# Altium project 一体机V1 修订2.PrjPcb (part 1 of 2)
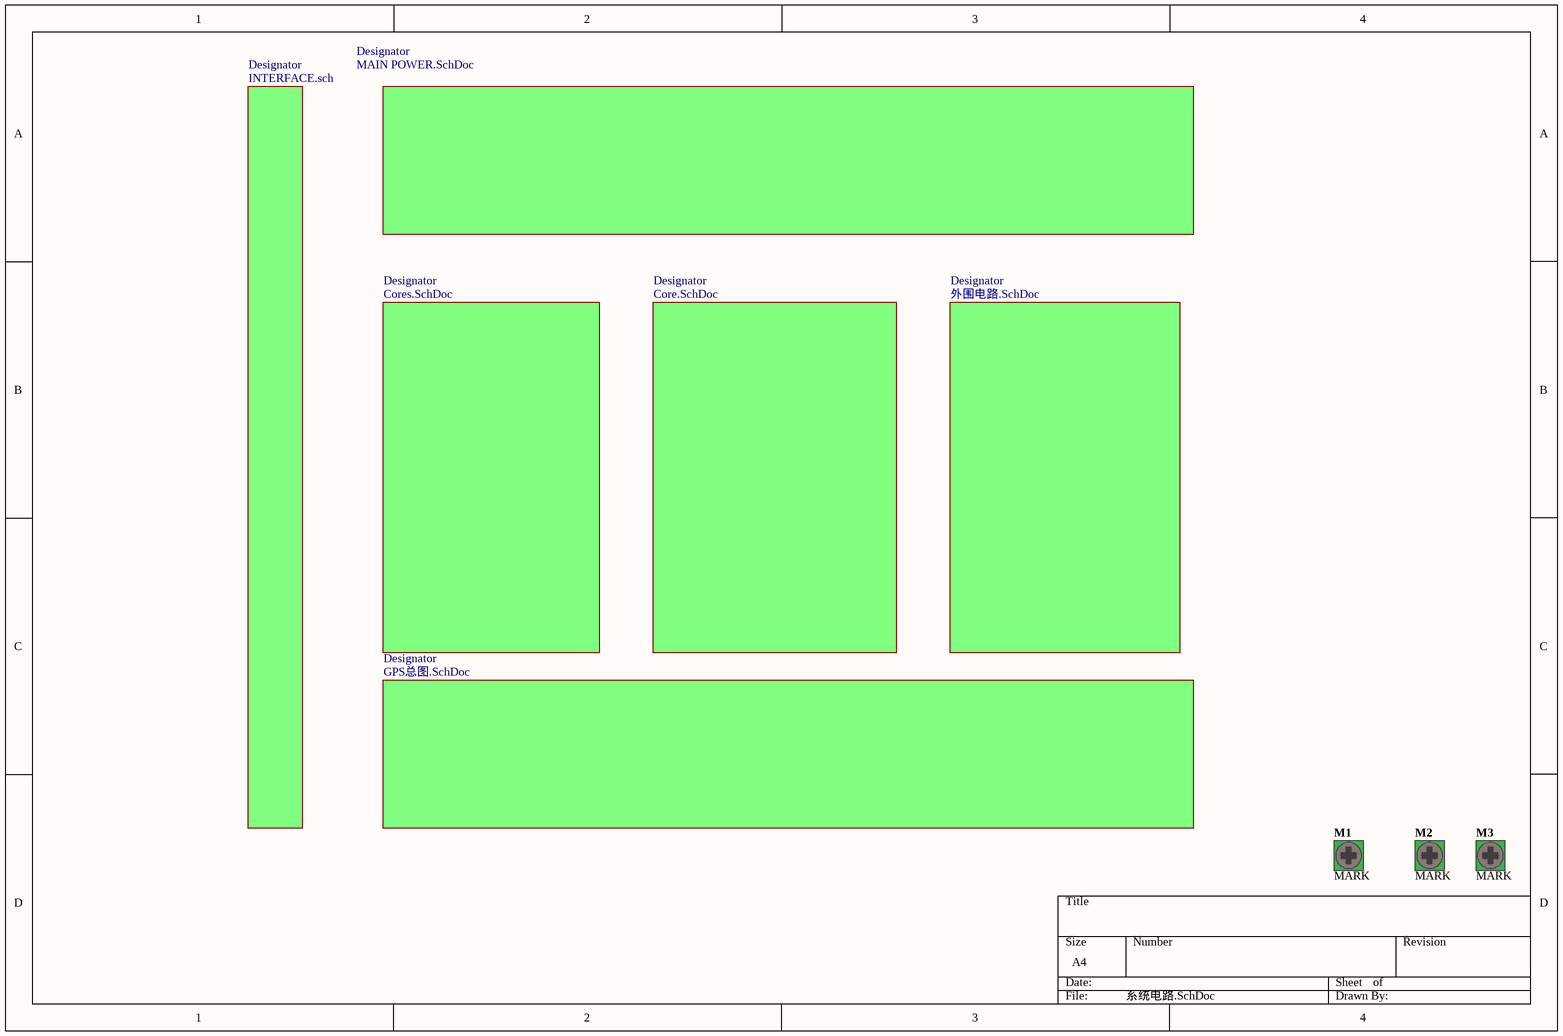
[diagram p0: 系统电路.SchDoc]
24 sheets, 224 parts. Net scope: global (net labels, ports and power ports of the same name join across sheets).
Board file: 一体机V1.PcbDoc
Sheets:
  系统电路.SchDoc
    Designator = Core.SchDoc
      Designator = ARM POWER.SchDoc
    Designator = MAIN POWER.SchDoc
    Designator = Cores.SchDoc
      Designator = JTAG.SchDoc
      Designator = RTC.SchDoc
      Designator = 按键接口.SchDoc
      Designator = 指示灯.SchDoc
      Designator = IIC.SchDoc
      Designator = RESET.SchDoc
      Designator = USB Device.SchDoc
      Designator = USB Host.SchDoc
      Designator = 蜂鸣器.SchDoc
      Designator = Cores POWER.SchDoc
      Designator = LVDS.SchDoc
    Designator = 外围电路.SchDoc
    Designator = GPS总图.SchDoc
      Designator = 12-MSP430.SchDoc
      Designator = 13-GPRS.SchDoc
      Designator = 14-GPS.SchDoc
      Designator = GPS POWER.SchDoc
      Designator = BAT POWER.SchDoc
      Designator = CD4060BM_硬件定时器.SchDoc

## Sheet 系统电路.SchDoc
size A4

### Parts
M1  MARK  [Mark]  (no BOM)
M2  MARK  [Mark]  (no BOM)
M3  MARK  [Mark]  (no BOM)

### Sub-sheets
Designator = Core.SchDoc: no entries
Designator = MAIN POWER.SchDoc: no entries
Designator = Cores.SchDoc: no entries
Designator = 外围电路.SchDoc: no entries
Designator = GPS总图.SchDoc: no entries
Designator = INTERFACE.sch (file not in this document): no entries

### Nets

Not connected (* = marked no-connect by the designer): M1 1; M2 1; M3 1

### Library data of the parts
M1-M3 = D-001-0001: Mounting Hole, M3 Screw, Plated, Square Pad; Status: Production; Category: Mounting-Hole

## Sheet Core.SchDoc
size A4
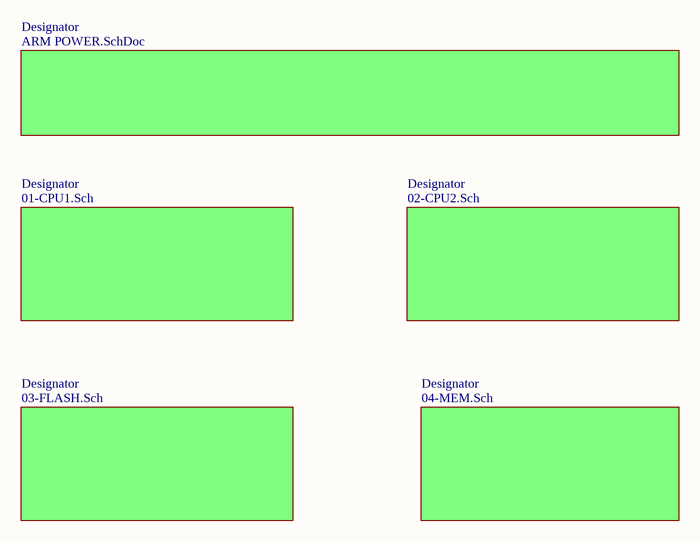
[diagram p1: Core.SchDoc]

### Sub-sheets
Designator = 01-CPU1.Sch (file not in this document): no entries
Designator = 02-CPU2.Sch (file not in this document): no entries
Designator = 04-MEM.Sch (file not in this document): no entries
Designator = ARM POWER.SchDoc: no entries
Designator = 03-FLASH.Sch (file not in this document): no entries

## Sheet ARM POWER.SchDoc
size A4
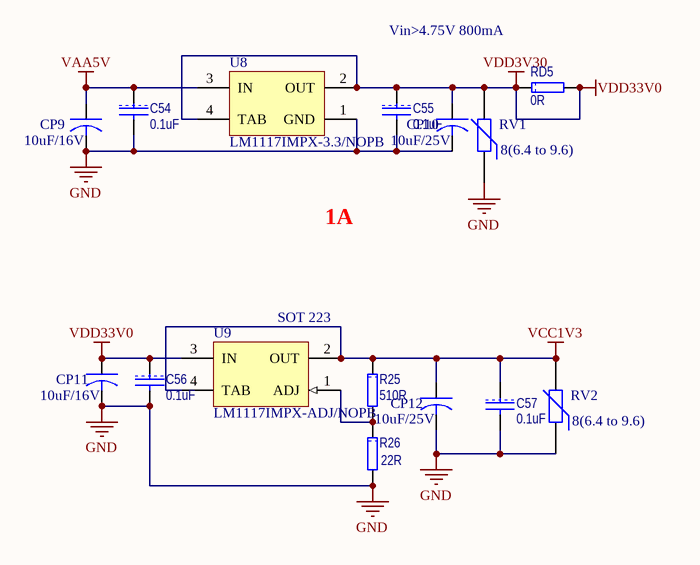
[diagram p2: ARM POWER.SchDoc]

### Parts
C54  0.1uF  [1608[0603]]
C55  0.1uF  [1608[0603]]
C56  0.1uF  [1608[0603]]
C57  0.1uF  [1608[0603]]
CP9  10uF/16V  [3216[1206]]
CP10  10uF/25V  [6032[2312]CC]
CP11  10uF/16V  [3216[1206]]
CP12  10uF/25V  [6032[2312]CC]
R25  510R  [1608[0603]R]
R26  22R  [1608[0603]R]
RD5  0R
RV1  8(6.4 to 9.6)  [1608[0603]RV]
RV2  8(6.4 to 9.6)  [1608[0603]RV]
U8  LM1117IMPX-3.3/NOPB  [MP04A_N]
U9  LM1117IMPX-ADJ/NOPB  [MP04A_N]

### Nets
GND: C54.2 C55.2 C56.2 C57.2 CP9.2 CP10.2 CP11.2 CP12.2 R26.2 RV1.1 RV2.1 U8.1(GND)
VAA5V: C54.1 CP9.1 U8.3(IN)
VCC1V3: C57.1 CP12.1 R25.1 RV2.2 U9.2(OUT) U9.4(TAB)
VDD33V0: C55.1 C56.1 CP10.1 CP11.1 RD5.1 RD5.2 RV1.2 U8.2(OUT) U8.4(TAB) U9.3(IN)  [also labelled VDD3V30]
NetR25_2: R25.2 R26.1 U9.1(ADJ)

### Notes on the sheet
- Vin>4.75V 800mA
- 1A
- (near U9) SOT 223

### Library data of the parts
C54-C57 = CAP: Capacitor; Manufacturer: TDK; Type: 无铅电容; Model: C0603X7R1H104K; Value: 0.1uF
CP9-CP12 = CAPACITOR: Tantalum Capacitor; Compy: TAJ; name: TAJ-A-106-M-010-R
R25 = RES: Manufacturer: vishay; Model: RT0603DRD7D510RL; Value: 510R; Type: 无铅电阻
R26 = RES: Manufacturer: vishay; Model: CRCW060322R0KKEDTR; Value: 22R; Type: 无铅电阻
RD5 = RES: Manufacturer: vishay; Model: RT0603DRD7D0RL; Value: 0R; Type: 无铅电阻
RV1 RV2 = Res Varistor: 压敏电阻; Manufacture: TDK; Value: AVR-M1608C080MAAB; Published: 24-Mar-1999; LatestRevisionDate: 29-May-2009; LatestRevisionNote: IPC-7351 Footprint Added.; PackageVersion: Mar-2003; PackageReference: 6-0805; Publisher: Altium Limited; PackageDescription: Chip Resistor 0805 Case Size; Code_IPC: RESC2012
U8 = LM1117MPX-3.3/NOPB: 800mA Low-Dropout Linear Regulator, 4-pin SOT-223, Pb-Free; Manufacturer: National Semiconductor; PackageTopMarking: XYTT*N05A; PowerWise: N; CompType: LDO IC; Published: 1-Mar-2010; DatasheetVersion: Apr-2006; PackageVersion: revB, Apr-2003; PackageReference: MP04A; Publisher: Altium Limited; PackageDescription: Molded SOT-223, 6.50 x 3.56 x 1.6mm Body, 4 Lead, 2.3mm Pitch; Supplier 1: Digi-Key; Supplier Part Number 1: LM1117MPX-3.3TR-ND; Supplier 2: Digi-Key; Supplier Part Number 2: LM1117MPX-3.3CT-ND; Supplier 3: Digi-Key; Supplier Part Number 3: LM1117MPX-3.3DKR-ND; PartNumber: LM1117MPX-3.3/NOPB; RoHS: Y; PinCount: 4; Code_JEDEC: TO-261-AA; Code_IPC: SOT223-4; ComponentLink1Description: LM1117 Datasheet; ComponentLink1URL: http://www.national.com/ds/LM/LM1117.pdf; ComponentLink2Description: LM1117 Web Page; ComponentLink2URL: http://www.national.com/pf/LM/LM1117.html; ComponentLink3Description: MP04A Package Page; ComponentLink3URL: http://www.national.com/packaging/folders/mp04a.html
U9 = LM1117MPX-ADJ/NOPB: 800mA Low-Dropout Linear Regulator, 4-pin SOT-223, Pb-Free; Manufacturer: National Semiconductor; PackageTopMarking: XYTT*N03A; PowerWise: N; CompType: LDO IC; Published: 1-Mar-2010; DatasheetVersion: Apr-2006; PackageVersion: revB, Apr-2003; PackageReference: MP04A; Publisher: Altium Limited; PackageDescription: Molded SOT-223, 6.50 x 3.56 x 1.6mm Body, 4 Lead, 2.3mm Pitch; Supplier 1: Digi-Key; Supplier Part Number 1: LM1117MPX-ADJ-ND; PartNumber: LM1117MPX-ADJ/NOPB; RoHS: Y; PinCount: 4; Code_JEDEC: TO-261-AA; Code_IPC: SOT223-4; ComponentLink1Description: LM1117 Datasheet; ComponentLink1URL: http://www.national.com/ds/LM/LM1117.pdf; ComponentLink2Description: LM1117 Web Page; ComponentLink2URL: http://www.national.com/pf/LM/LM1117.html; ComponentLink3Description: MP04A Package Page; ComponentLink3URL: http://www.national.com/packaging/folders/mp04a.html

## Sheet MAIN POWER.SchDoc
size A4
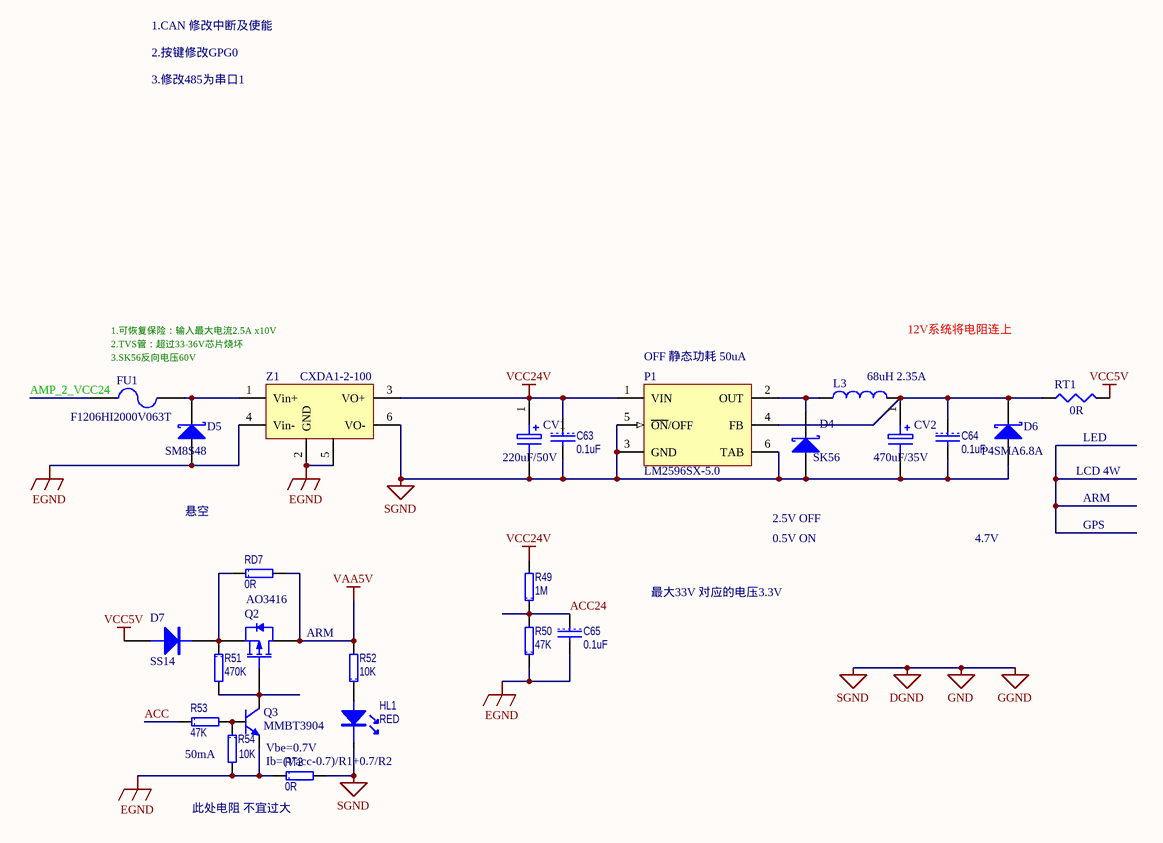
[diagram p3: MAIN POWER.SchDoc]

### Parts
C63  0.1uF  [1608[0603]]
C64  0.1uF  [1608[0603]]
C65  0.1uF  [1608[0603]]
CV1  220uF/50V  [CAPPR5-10x20/H1.1]
CV2  470uF/35V  [CAPPR5-10x20/H1.1]
D4  SK56  [DIODE_SMC]
D5  SM8S48  [DIODE_SMC]
D6  P4SMA6.8A  [SMA]
D7  SS14  [SMA]
FU1  F1206HI2000V063T  [RAD-0.3]
HL1  RED  [0805LED]
L3  value 68uH 2.35A  [INDP125125X85N]  (hidden comment: B82477P4683M000)
P1  LM2596SX-5.0  [TS5B_N]
Q2  AO3416  [SOT23_N]
Q3  MMBT3904  [SOT23-NPN]
R49  1M  [1608[0603]R]
R50  47K  [1608[0603]R]
R51  470K  [1608[0603]R]
R52  10K  [1608[0603]R]
R53  47K  [1608[0603]R]
R54  10K  [1608[0603]R]
RD7  0R  [1608[0603]RD]
RT1  0R  [2012[0805]]
RT2  0R  [1608[0603]RD]
Z1  CXDA1-2-100  [CXDA1-2-100]

### Nets
EGND: C65.2 D5.1(A) Q3.1 R50.1 R54.2 RT2.1 Z1.2(GND) Z1.4(Vin-) Z1.5(GND)
GND: C63.2 C64.2 CV1.2 CV2.2 D4.1(A) D6.1(A) HL1.2 P1.3(GND) P1.5(~{ON}/OFF) P1.6(TAB) RT2.2 Z1.6(VO-)  [also labelled DGND, GGND, SGND]
VAA5V: Q2.3(D) R52.2 RD7.2
VCC5V: D7.1(A) RT1.2
VCC24V: C63.1 CV1.1 P1.1(VIN) R49.2 Z1.3(VO+)
ACC: R53.1
ACC24: C65.1 R49.1 R50.2
AMP_2_VCC24: FU1.1
NetC64_1: C64.1 CV2.1 D6.2(K) L3.2 P1.4(FB) RT1.1
NetD4_2: D4.2(K) L3.1 P1.2(OUT)
NetD5_2: D5.2(K) FU1.2 Z1.1(Vin+)
NetD7_2: D7.2(K) Q2.2(S) R51.1 RD7.1
NetHL1_1: HL1.1 R52.1
NetQ2_1: Q2.1(G) Q3.3 R51.2
NetQ3_2: Q3.2 R53.2 R54.1

### Notes on the sheet
- 1.CAN 修改中断及使能
- 2.按键修改GPG0
- 3.修改485为串口1
- 1.可恢复保险：输入最大电流2.5A x10V
- 2.TVS管：超过33-36V芯片烧坏
- (near FU1) 3.SK56反向电压60V
- (near P1) OFF 静态功耗 50uA
- 12V系统将电阻连上
- (near RT1) LED
- LCD 4W
- ARM
- 悬空
- 2.5V OFF
- 0.5V ON
- 4.7V
- GPS
- 最大33V 对应的电压3.3V
- 50mA
- (near Q3) Vbe=0.7V
- Ib=(Vacc-0.7)/R1+0.7/R2
- 此处电阻 不宜过大

### Library data of the parts
C63-C65 = CAP: as C54 on sheet ARM POWER; Value: 0.1uF
CV1 = ELECTRO1: aluminum electrolytic capacitor; Manufacturer: Yageo; Value: 220uF; Model: SL050K0220A5S-1019; Parameter: 220uF/50V
CV2 = ELECTRO1: aluminum electrolytic capacitor; Manufacturer: Yageo; Value: 470uF; Model: SL050K0220A5S-1019; Parameter: 470uF/35V
D4 = D Schottky: 肖特基二极管; Published: 8-Jun-2000; LatestRevisionDate: 17-Jul-2002; LatestRevisionNote: Re-released for DXP Platform.; PackageReference: SMB; Publisher: Altium Limited; PackageDescription: DO-214-AA/SMB; 2 C-Bend Leads; Body 5.3 x 3.6 mm, inc. leads (LxW); Code_JEDEC: DO-214-AA
D5 D6 = 30BQ040: TVS; 公司: Vishay; Published: 8-Jun-2000; LatestRevisionDate: 17-Jul-2002; LatestRevisionNote: Re-released for DXP Platform.; DatasheetVersion: PD-2.439; PackageReference: SMC; Publisher: Altium Limited; PackageDescription: DO-214-AB/SMC; 2 C-Bend Leads; Body 7.9 x 5.9 mm, inc. leads (LxW); Code_JEDEC: DO-214-AB; ComponentLink1Description: Manufacturer Link; ComponentLink1URL: http://www.irf.com/; ComponentLink2Description: Datasheet; ComponentLink2URL: http://www.irf.com/product-info/datasheets/data/30bq040.pdf; 参数: *
D7 = DIODE
FU1 = Fuse 2: FUSE; 公司: 美国泰科; 参数: 63V 2A; Published: 8-Jun-2000; LatestRevisionDate: 17-Jul-2002; LatestRevisionNote: Re-released for DXP Platform.; PackageReference: PIN-W2/E2.8; Publisher: Altium Limited; PackageDescription: Thru-Hole; 2 Leads
HL1 = LED: 发光管; Votage: 1.82-1.88V; I: 5-8mA
L3 = Inductor: Code_IEC: 1005; parameters: 3.5A; 公司: epcos; Published: 8-Jun-2000; LatestRevisionDate: 29-May-2009; LatestRevisionNote: IPC-7351 Footprint Added.; PackageReference: 0402-A; Publisher: Altium Limited; PackageDescription: Chip Inductor; Code_JEITA: 0402; Manufacturer: *
P1 = LM2596SX-12: POWER; Manufacturer: National Semiconductor; PackageTopMarking: NSUZXYTTE#*LM2596S*-12 P+; PowerWise: N; CompType: Switcher; Published: 1-Mar-2010; DatasheetVersion: May-2002; PackageVersion: revD, Apr-2005; PackageReference: TS5B; Publisher: Altium Limited; PackageDescription: TO-263, Molded, .400 x .390 x .180in, 5 Lead, .067in Pitch, Surface Mount; PartNumber: LM2596SX-12; RoHS: N; PinCount: 5; Code_JEDEC: MO-169-AB; ComponentLink1Description: LM2596 Datasheet; ComponentLink1URL: http://www.national.com/ds/LM/LM2596.pdf; ComponentLink2Description: LM2596 Web Page; ComponentLink2URL: http://www.national.com/pf/LM/LM2596.html; ComponentLink3Description: TS5B Package Page; ComponentLink3URL: http://www.national.com/packaging/folders/ts5b.html; Supplier 1: Digi-Key; Supplier Part Number 1: LM2596SX-12-ND
Q2 = BSH205: P-channel Enhancement Mode MOSFET; Published: 17-Sep-2003; LatestRevisionDate: 12-Dec-2006; LatestRevisionNote: IPC-7351 Footprint Added.; DatasheetVersion: Aug-1998; PackageVersion: May-1999; PackageReference: SOT23; Publisher: Altium Limited; PackageDescription: 3-Pin SOT-23 Package 0.95 mm Pitch, 2.3 mm Lead Span; ComponentLink1Description: Manufacturer Link; ComponentLink1URL: http://www.semiconductors.philips.com/; ComponentLink2Description: Datasheet; ComponentLink2URL: http://www.semiconductors.philips.com/acrobat/datasheets/BSH205_3.pdf
R49 = RES: Manufacturer: vishay; Model: CRCW06031M0KKEDTR; Value: 1M; Type: 无铅电阻
R50 R51 = RES: Manufacturer: vishay; Model: CRCW0603470K0KKEDTR; Type: 无铅电阻
  R50: Value: 47K
  R51: Value: 470K
R52 = RES: Manufacturer: vishay; Model: CRCW060310K0KKEDTR; Value: 10K; Type: 无铅电阻
R53 = RES: Manufacturer: vishay; Model: CRCW060347K0KKEDTR; Value: 47K; Type: 无铅电阻
R54 = RES: Manufacturer: vishay; Model: CRCW060310K0KKEDTR; Parameters: 50V 1/10W 0.5%; Type: 无铅电阻; Value: 10K
RD7 = RES: as RD5 on sheet ARM POWER; Value: 0R; Type: 无铅电阻
RT1 = Res3: 电阻; Manufacturer: Yageo; Model: RT0805DRD7D0RL; Published: 8-Jun-2000; LatestRevisionDate: 29-May-2009; LatestRevisionNote: IPC-7351 Footprint Added.; PackageReference: J1-0603; Publisher: Altium Limited; PackageDescription: Chip Resistor; Value: 0R; Type: RES
RT2 = RES: Manufacturer: vishay; Model: CRCW06030R0KKEDTR; Value: 0R; Type: 无铅电阻
Z1 = CXDB: Filter; 公司: 中北创新

## Sheet Cores.SchDoc
size A4
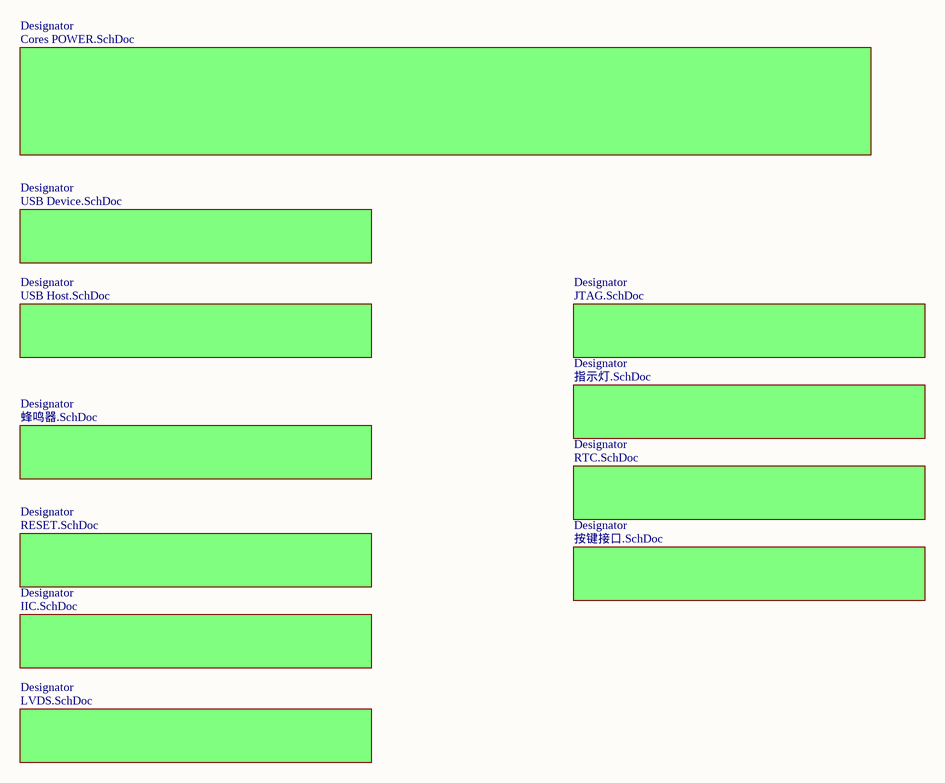
[diagram p4: Cores.SchDoc]

### Sub-sheets
Designator = JTAG.SchDoc: no entries
Designator = RTC.SchDoc: no entries
Designator = 按键接口.SchDoc: no entries
Designator = 指示灯.SchDoc: no entries
Designator = IIC.SchDoc: no entries
Designator = RESET.SchDoc: no entries
Designator = USB Device.SchDoc: no entries
Designator = USB Host.SchDoc: no entries
Designator = 蜂鸣器.SchDoc: no entries
Designator = Cores POWER.SchDoc: no entries
Designator = LVDS.SchDoc: no entries

## Sheet JTAG.SchDoc
size A4
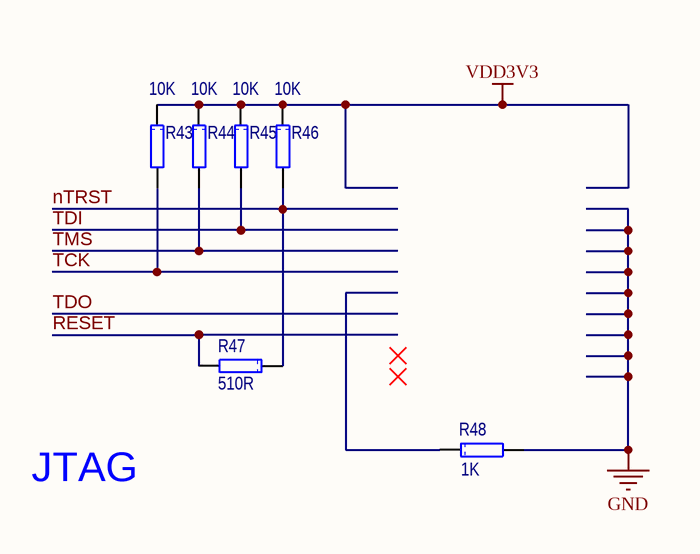
[diagram p5: JTAG.SchDoc]

### Parts
R43  10K  [1608[0603]R]
R44  10K  [1608[0603]R]
R45  10K  [1608[0603]R]
R46  10K  [1608[0603]R]
R47  510R  [1608[0603]R]
R48  1K

### Nets
GND: R48.2
VDD3V3: R43.1 R44.1 R45.1 R46.1
nTRST: R46.2 R47.1
RESET: R47.2
TCK: R43.2
TDI: R45.2
TMS: R44.2

Not connected (* = marked no-connect by the designer): R48 1

### Notes on the sheet
- JTAG

### Library data of the parts
R43-R46 = RES: as R54 on sheet MAIN POWER; Type: 无铅电阻; Value: 10K
R47 = RES: as R25 on sheet ARM POWER; Value: 510R; Type: 无铅电阻
R48 = RES: Manufacturer: vishay; Model: CRCW06031K0KKEDTR; Value: 1K; Type: 无铅电阻

## Sheet RTC.SchDoc
size A4
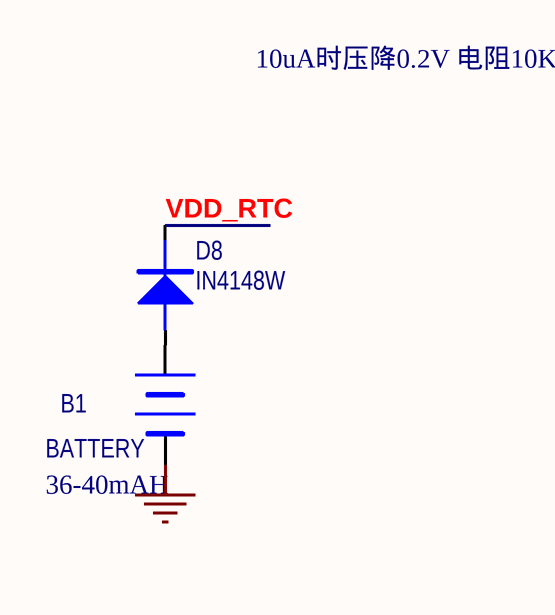
[diagram p6: RTC.SchDoc]

### Parts
B1  BATTERY  volume: 36-40mAH  [BR2032-1GV]
D8  IN4148W  [SOD123]

### Nets
GND: B1.2
VDD_RTC: D8.2
NetB1_1: B1.1 D8.1

### Notes on the sheet
- 10uA时压降0.2V 电阻10K

### Library data of the parts
B1 = BATTERY: 电池座
D8 = DIODE

## Sheet 按键接口.SchDoc
size A4
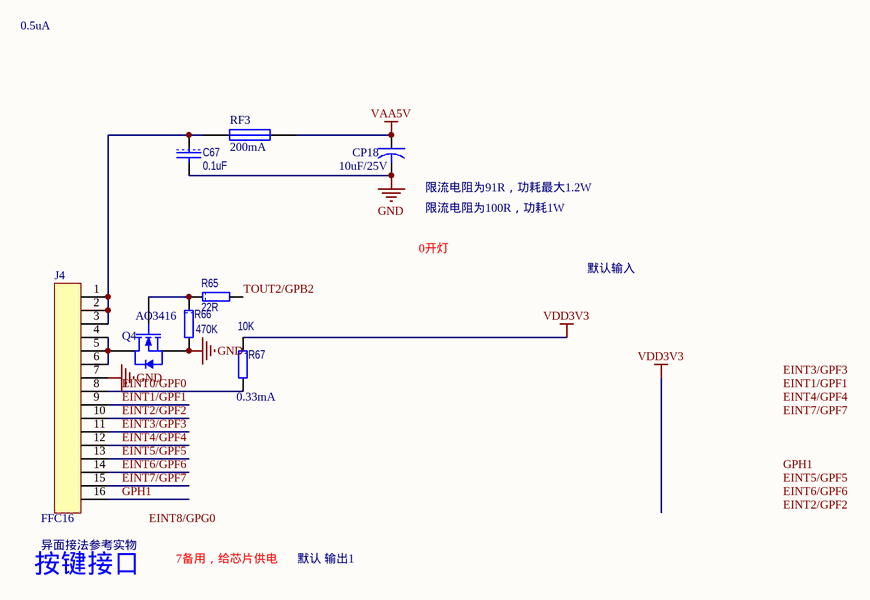
[diagram p7: 按键接口.SchDoc]

### Parts
C67  0.1uF  [1608[0603]]
CP18  10uF/25V  [6032[2312]CC]
J4  FFC16  [FFC/SM0.5-2H16]
Q4  AO3416  [SOT23_N]
R65  22R  [1608[0603]R]
R66  470K  [1608[0603]R]
R67  10K  [1608[0603]R]
RF3  value 200mA  [2012[0805]F]  (hidden comment: NanoSMDC020F)

### Nets
GND: C67.2 CP18.2 J4.7 Q4.2(S) R66.2
VAA5V: CP18.1 RF3.2
VDD3V3: R67.1
EINT0/GPF0: J4.8 R67.2
EINT1/GPF1: J4.9
EINT2/GPF2: J4.10
EINT3/GPF3: J4.11
EINT4/GPF4: J4.12
EINT5/GPF5: J4.13
EINT6/GPF6: J4.14
EINT7/GPF7: J4.15
GPH1: J4.16
TOUT2/GPB2: R65.2
NetC67_1: C67.1 J4.1 J4.2 J4.3 RF3.1
NetJ4_4: J4.4 J4.5 J4.6 Q4.3(D)
NetQ4_1: Q4.1(G) R65.1 R66.1

### Notes on the sheet
- 0.5uA
- (near CP18) 限流电阻为91R，功耗最大1.2W
- 0开灯
- (near CP18) 限流电阻为100R，功耗1W
- 默认输入
- (near R67) 0.33mA
- (near J4) 按键接口
- (near J4) 异面接法参考实物
- 7备用，给芯片供电
- 默认 输出1
- Labels drawn without touching a wire or pin: EINT1/GPF1, EINT2/GPF2, EINT3/GPF3, EINT4/GPF4, EINT5/GPF5, EINT6/GPF6, EINT7/GPF7, EINT8/GPG0, GPH1

### Library data of the parts
C67 = CAP: as C54 on sheet ARM POWER; Value: 0.1uF
CP18 = CAPACITOR: as CP9 on sheet ARM POWER
J4 = 16PIN: CON
Q4 = 2N7002: NMOS; Published: 17-Sep-2003; LatestRevisionDate: 12-Dec-2006; LatestRevisionNote: IPC-7351 Footprint Added.; DatasheetVersion: 27-Jul-2000; PackageVersion: May-1999; PackageReference: SOT23; Publisher: Altium Limited; PackageDescription: 3-Pin SOT-23 Package 0.95 mm Pitch, 2.3 mm Lead Span; ComponentLink1Description: Manufacturer Link; ComponentLink1URL: http://www.semiconductors.philips.com/; ComponentLink2Description: Datasheet; ComponentLink2URL: http://www.semiconductors.philips.com/acrobat/datasheets/2N7002_4.pdf
R65 = RES: Manufacturer: vishay; Model: CRCW060322R0KKEDTR; Parameters: 50V 1/10W 0.5%; Type: 无铅电阻; Value: 22R
R66 = RES: Manufacturer: vishay; Model: CRCW0603470K0KKEDTR; Parameters: 50V 1/10W 0.5%; Type: 无铅电阻; Value: 470K
R67 = RES: as R54 on sheet MAIN POWER; Type: 无铅电阻; Value: 10K
RF3 = FUSE1: FUSE; 公司: 美国泰科

## Sheet 指示灯.SchDoc
size A4
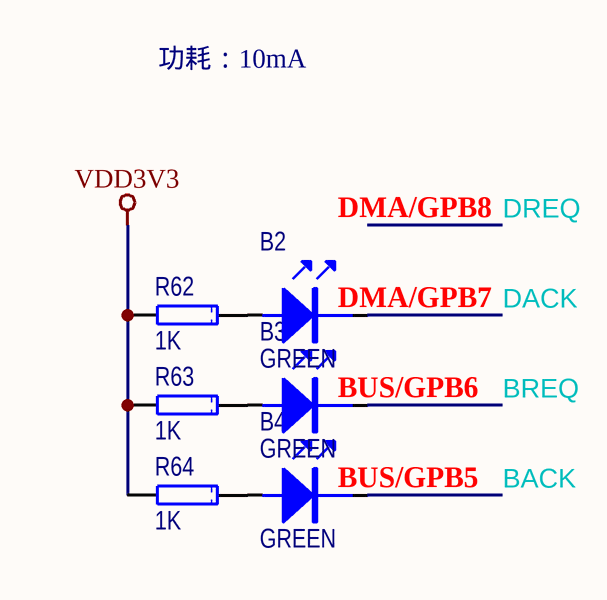
[diagram p8: 指示灯.SchDoc]

### Parts
B2  GREEN  [0805LED]
B3  GREEN  [0805LED]
B4  GREEN  [0805LED]
R62  1K  [1608[0603]R]
R63  1K  [1608[0603]R]
R64  1K  [1608[0603]R]

### Nets
VDD3V3: R62.2 R63.2 R64.2
BACK: B4.2
BREQ: B3.2
DACK: B2.2
NetB2_1: B2.1 R62.1
NetB3_1: B3.1 R63.1
NetB4_1: B4.1 R64.1

### Notes on the sheet
- 功耗：10mA
- (near B2) DMA/GPB7
- (near B2) DMA/GPB8
- (near B4) BUS/GPB5
- (near B3) BUS/GPB6

### Library data of the parts
B2-B4 = LED: 发光管
R62-R64 = RES: as R48 on sheet JTAG; Value: 1K; Type: 无铅电阻

## Sheet IIC.SchDoc
size A4
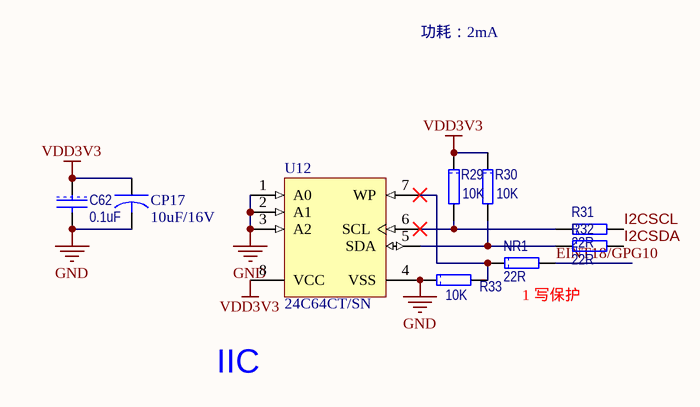
[diagram p9: IIC.SchDoc]

### Parts
C62  0.1uF  [1608[0603]]
CP17  10uF/16V  [3216[1206]]
NR1  22R  [1608[0603]R]
R29  10K  [1608[0603]R]
R30  10K  [1608[0603]R]
R31  22R  [1608[0603]R]
R32  22R  [1608[0603]R]
R33  10K  [1608[0603]R]
U12  24C64CT/SN  [SOIC8_N]

### Nets
GND: C62.2 CP17.2 R33.1 U12.1(A0) U12.2(A1) U12.3(A2) U12.4(VSS)
VDD3V3: C62.1 CP17.1 R29.1 R30.1 U12.8(VCC)
EINT18/GPG10: NR1.2
I2CSCL: R31.2
I2CSDA: R32.2
NetNR1_1: NR1.1 R33.2 U12.7(WP)
NetR29_2: R29.2 R31.1 U12.6(SCL)
NetR30_2: R30.2 R32.1 U12.5(SDA)

### Notes on the sheet
- 功耗：2mA
- (near NR1) 1 写保护
- (near U12) IIC

### Library data of the parts
C62 = CAP: as C54 on sheet ARM POWER; Value: 0.1uF
CP17 = CAPACITOR: Tantalum Capacitor
NR1 R31 R32 = RES: as R26 on sheet ARM POWER; Value: 22R; Type: 无铅电阻
R29 R30 = RES: as R52 on sheet MAIN POWER; Value: 10K; Type: 无铅电阻
R33 = RES: as R54 on sheet MAIN POWER; Type: 无铅电阻; Value: 10K
U12 = 24C02CT/SN: IC; Published: 29-Jan-2009; DatasheetVersion: revJ, Aug-2008; PackageVersion: revBB, Aug-2009; PackageReference: SOIC-SN8; Publisher: Altium Limited; PackageDescription: 8-Lead Plastic Small Outline (SN) - Narrow, 3.90mm Body [SOIC]; Supplier 1: Digi-Key; Supplier Part Number 1: 24C02CT/SN-ND; Code_JEDEC: MS-012; Code_IPC: SOIC127P600-8; ComponentLink1Description: Datasheet; ComponentLink1URL: http://ww1.microchip.com/downloads/en/DeviceDoc/21202J.pdf; ComponentLink2Description: Packaging Specification; ComponentLink2URL: http://www.microchip.com/stellent/groups/techpub_sg/documents/packagingspec/en012702.pdf; ComponentLink3Description: Microchip.com Home; ComponentLink3URL: http://www.microchip.com/; Supplier 2: Newark; Supplier Part Number 2: 08R5417

## Sheet RESET.SchDoc
size A4
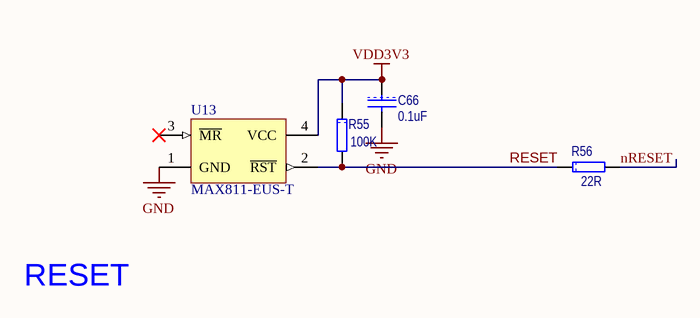
[diagram p10: RESET.SchDoc]

### Parts
C66  0.1uF  [1608[0603]]
R55  100K  [1608[0603]R]
R56  22R  [1608[0603]R]
U13  MAX811-EUS-T  [SOT143_N]

### Nets
GND: C66.2 U13.1(GND)
VDD3V3: C66.1 R55.1 U13.4(VCC)
nRESET: R56.2
RESET: R55.2 R56.1 U13.2(~{RST})

Not connected (* = marked no-connect by the designer): U13 3(~{MR})*

### Notes on the sheet
- RESET

### Library data of the parts
C66 = CAP: as C54 on sheet ARM POWER; Value: 0.1uF
R55 = RES: Manufacturer: vishay; Model: RT0603DRD7D10KL; Parameters: 50V 1/10W 0.5%; Type: 无铅电阻; Value: 100K
R56 = RES: as R26 on sheet ARM POWER; Value: 22R; Type: 无铅电阻
U13 = MAX811-EUS-T: IC; Published: 16-Jan-2001; LatestRevisionDate: 29-May-2009; LatestRevisionNote: IPC-7351 Footprint Added.; DatasheetVersion: Feb-1998; PackageVersion: Feb-1998; PackageReference: SOT143; Publisher: Altium Limited; PackageDescription: 4-Pin SOT-143 Package 1.9 mm Pitch, 2.3 mm Lead Span; ComponentLink1Description: Manufacturer Link; ComponentLink1URL: http://www.maxim-ic.com/; ComponentLink2Description: Datasheet; ComponentLink2URL: http://pdfserv.maxim-ic.com/en/ds/MAX811-MAX812.pdf; Supplier 1: Digi-Key; Supplier Part Number 1: MAX811SEUS+TTR-ND

## Sheet USB Device.SchDoc
size A4
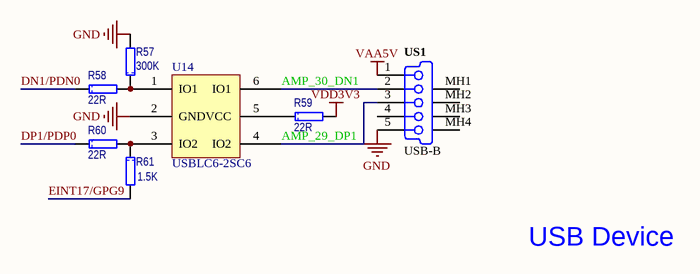
[diagram p11: USB Device.SchDoc]

### Parts
R57  300K  [1608[0603]R]
R58  22R  [1608[0603]R]
R59  22R  [1608[0603]R]
R60  22R  [1608[0603]R]
R61  1.5K  [1608[0603]R]
U14  USBLC6-2SC6  [SOT26A-6N]
US1  USB-B  [USB/SM0.8-6H5]

### Nets
GND: R57.2 U14.2(GND) US1.5
VAA5V: US1.1
VDD3V3: R59.2
AMP_29_DP1: U14.4(IO2) US1.3
AMP_30_DN1: U14.6(IO1) US1.2
DN1/PDN0: R58.1
DP1/PDP0: R60.1
EINT17/GPG9: R61.2
NetR57_1: R57.1 R58.2 U14.1(IO1)
NetR59_1: R59.1 U14.5(VCC)
NetR60_2: R60.2 R61.1 U14.3(IO2)

Not connected (* = marked no-connect by the designer): US1 4 MH1 MH2 MH3 MH4

### Notes on the sheet
- USB Device

### Library data of the parts
R57 = RES: Manufacturer: vishay; Model: RT0603DRD7D300KL; Value: 300K; Type: 无铅电阻
R58-R60 = RES: as R26 on sheet ARM POWER; Value: 22R; Type: 无铅电阻
R61 = RES: Manufacturer: vishay; Model: RT0603DRD7D1KL; Value: 1.5K; Type: 无铅电阻
U14 = USBLC6-2SC6: ESD; 公司: ST
US1 = D-300-0034: USB On-The-Go (OTG) Mini-B Receptacle, Right Angle, SMT, 0.80mm (.031") Pitch, Solder Tabs with Back Cover, Recessed Type; Max Current: mA; Connector type: Right Angle; Mounting Technology: Surface Mount; Status: Unreleased; Category: Connector

## Sheet USB Host.SchDoc
size A4
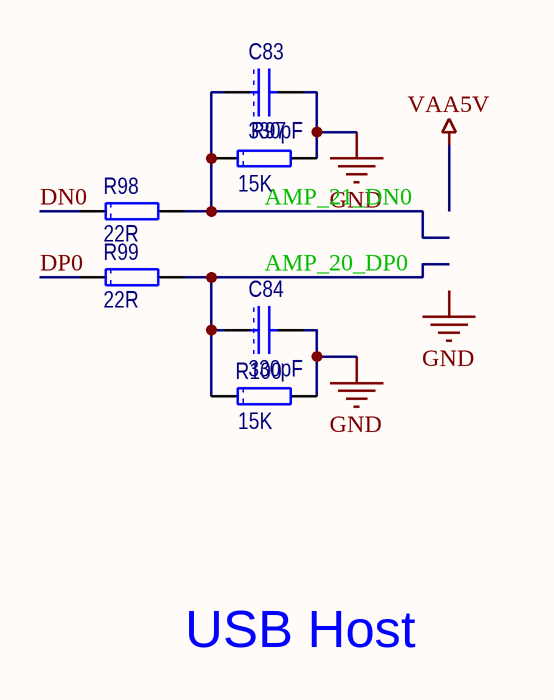
[diagram p12: USB Host.SchDoc]

### Parts
C83  330pF  [1608[0603]]
C84  330pF  [1608[0603]]
R97  15K  [1608[0603]R]
R98  22R  [1608[0603]R]
R99  22R  [1608[0603]R]
R100  15K  [1608[0603]R]

### Nets
GND: C83.2 C84.2 R97.2 R100.2
AMP_20_DP0: C84.1 R99.2 R100.1
AMP_21_DN0: C83.1 R97.1 R98.2
DN0: R98.1
DP0: R99.1

### Notes on the sheet
- USB Host
- Labels drawn without touching a wire or pin: GND

### Library data of the parts
C83 C84 = CAP: Capacitor; Manufacturer: TDK; Type: 无铅电容; Model: C0603X7R1H331K; Value: 330pF
R97 R100 = RES: Manufacturer: vishay; Model: RT0603DRD7D15KL; Value: 15K; Type: 无铅电阻
R98 R99 = RES: as R26 on sheet ARM POWER; Value: 22R; Type: 无铅电阻

## Sheet 蜂鸣器.SchDoc
size A4
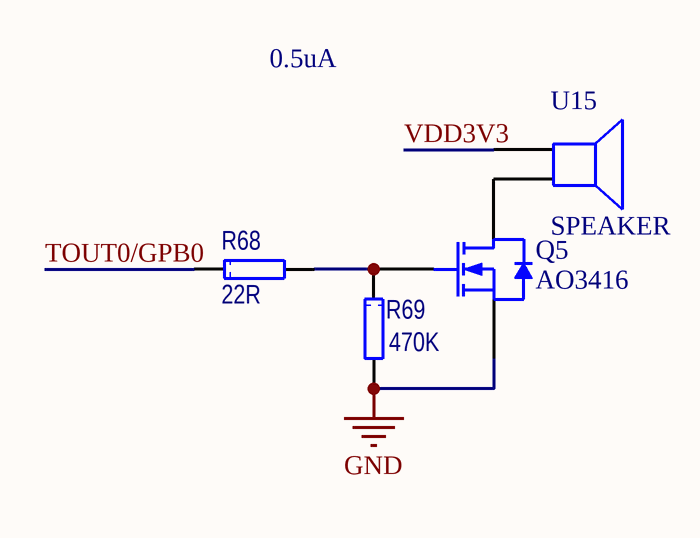
[diagram p13: 蜂鸣器.SchDoc]

### Parts
Q5  AO3416  [SOT23_N]
R68  22R  [1608[0603]R]
R69  470K  [1608[0603]R]
U15  SPEAKER  [Speaker]

### Nets
GND: Q5.2(S) R69.2
VDD3V3: U15.1
TOUT0/GPB0: R68.1
NetQ5_1: Q5.1(G) R68.2 R69.1
NetQ5_3: Q5.3(D) U15.2

### Notes on the sheet
- 0.5uA

### Library data of the parts
Q5 = 2N7002: NMOS; Published: 17-Sep-2003; LatestRevisionDate: 12-Dec-2006; LatestRevisionNote: IPC-7351 Footprint Added.; DatasheetVersion: 27-Jul-2000; PackageVersion: May-1999; PackageReference: SOT23; Publisher: Altium Limited; PackageDescription: 3-Pin SOT-23 Package 0.95 mm Pitch, 2.3 mm Lead Span; ComponentLink1Description: Manufacturer Link; ComponentLink1URL: http://www.semiconductors.philips.com/; ComponentLink2Description: Datasheet; ComponentLink2URL: http://www.semiconductors.philips.com/acrobat/datasheets/2N7002_4.pdf
R68 = RES: as R65 on sheet 按键接口; Type: 无铅电阻; Value: 22R
R69 = RES: as R66 on sheet 按键接口; Type: 无铅电阻; Value: 470K
U15 = SPEAKER: BUZ

## Sheet Cores POWER.SchDoc
size A4
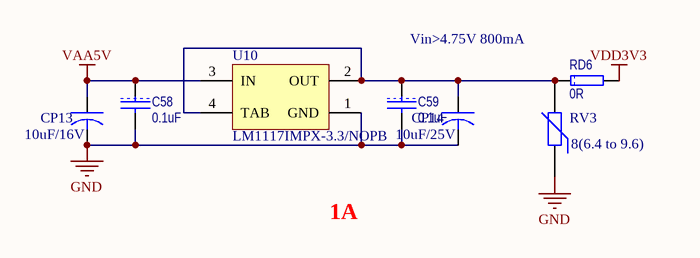
[diagram p14: Cores POWER.SchDoc]

### Parts
C58  0.1uF  [1608[0603]]
C59  0.1uF  [1608[0603]]
CP13  10uF/16V  [3216[1206]]
CP14  10uF/25V  [6032[2312]CC]
RD6  0R  [1608[0603]RD]
RV3  8(6.4 to 9.6)  [1608[0603]RV]
U10  LM1117IMPX-3.3/NOPB  [MP04A_N]

### Nets
GND: C58.2 C59.2 CP13.2 CP14.2 RV3.1 U10.1(GND)
VAA5V: C58.1 CP13.1 U10.3(IN)
VDD3V3: RD6.2
NetC59_1: C59.1 CP14.1 RD6.1 RV3.2 U10.2(OUT) U10.4(TAB)

### Notes on the sheet
- Vin>4.75V 800mA
- 1A

### Library data of the parts
C58 C59 = CAP: as C54 on sheet ARM POWER; Value: 0.1uF
CP13 CP14 = CAPACITOR: as CP9 on sheet ARM POWER
RD6 = RES: as RD5 on sheet ARM POWER; Value: 0R; Type: 无铅电阻
RV3 = Res Varistor: as RV1 on sheet ARM POWER; Published: 24-Mar-1999; LatestRevisionDate: 29-May-2009; LatestRevisionNote: IPC-7351 Footprint Added.; PackageVersion: Mar-2003; PackageReference: 6-0805; Publisher: Altium Limited; PackageDescription: Chip Resistor 0805 Case Size; Code_IPC: RESC2012
U10 = LM1117MPX-3.3/NOPB: as U8 on sheet ARM POWER; Published: 1-Mar-2010; DatasheetVersion: Apr-2006; PackageVersion: revB, Apr-2003; PackageReference: MP04A; Publisher: Altium Limited; PackageDescription: Molded SOT-223, 6.50 x 3.56 x 1.6mm Body, 4 Lead, 2.3mm Pitch; Supplier 1: Digi-Key; Supplier Part Number 1: LM1117MPX-3.3TR-ND; Supplier 2: Digi-Key; Supplier Part Number 2: LM1117MPX-3.3CT-ND; Supplier 3: Digi-Key; Supplier Part Number 3: LM1117MPX-3.3DKR-ND; PartNumber: LM1117MPX-3.3/NOPB; RoHS: Y; PinCount: 4; Code_JEDEC: TO-261-AA; Code_IPC: SOT223-4; ComponentLink1Description: LM1117 Datasheet; ComponentLink1URL: http://www.national.com/ds/LM/LM1117.pdf; ComponentLink2Description: LM1117 Web Page; ComponentLink2URL: http://www.national.com/pf/LM/LM1117.html; ComponentLink3Description: MP04A Package Page; ComponentLink3URL: http://www.national.com/packaging/folders/mp04a.html

## Sheet LVDS.SchDoc
size A4
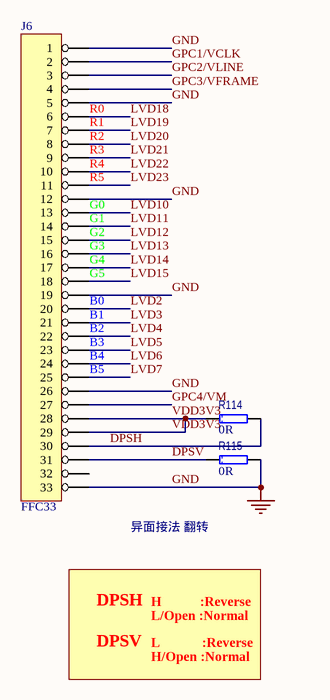
[diagram p15: LVDS.SchDoc]

### Parts
J6  FFC33  [FFC/SM0.5-2H33]
R114  0R  [1608[0603]R]
R115  0R  [1608[0603]R]

### Nets
GND: J6.1 J6.5 J6.12 J6.19 J6.26 J6.33 R115.2
VDD3V3: J6.28 J6.29 R114.1
DPSH: J6.30 R114.2
DPSV: J6.31 R115.1
GPC1/VCLK: J6.2
GPC2/VLINE: J6.3
GPC3/VFRAME: J6.4
GPC4/VM: J6.27
LVD2: J6.20
LVD3: J6.21
LVD4: J6.22
LVD5: J6.23
LVD6: J6.24
LVD7: J6.25
LVD10: J6.13
LVD11: J6.14
LVD12: J6.15
LVD13: J6.16
LVD14: J6.17
LVD15: J6.18
LVD18: J6.6
LVD19: J6.7
LVD20: J6.8
LVD21: J6.9
LVD22: J6.10
LVD23: J6.11

Not connected (* = marked no-connect by the designer): J6 32

### Notes on the sheet
- (near J6) R0
- (near J6) R1
- (near J6) R2
- (near J6) R3
- (near J6) R4
- (near J6) R5
- (near J6) G0
- (near J6) G1
- (near J6) G2
- (near J6) G3
- (near J6) G4
- (near J6) G5
- (near J6) B0
- (near J6) B1
- (near J6) B2
- (near J6) B3
- (near J6) B4
- (near J6) B5
- (near J6) 异面接法 翻转
- DPSH
- DPSV
- H           :Reverse
- L/Open :Normal
- L            :Reverse
- H/Open :Normal

### Library data of the parts
J6 = HEADER 33: CON
R114 R115 = RES: as RD5 on sheet ARM POWER; Value: 0R; Type: 无铅电阻

## Sheet 外围电路.SchDoc
size A4
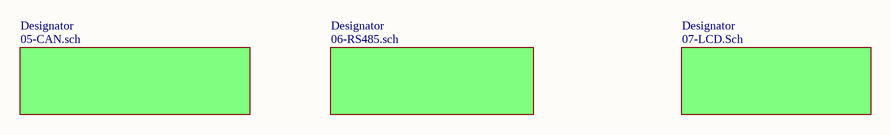
[diagram p16: 外围电路.SchDoc]

### Sub-sheets
Designator = 06-RS485.sch (file not in this document): no entries
Designator = 07-LCD.Sch (file not in this document): no entries
Designator = 05-CAN.sch (file not in this document): no entries

## Sheet GPS总图.SchDoc
size A4
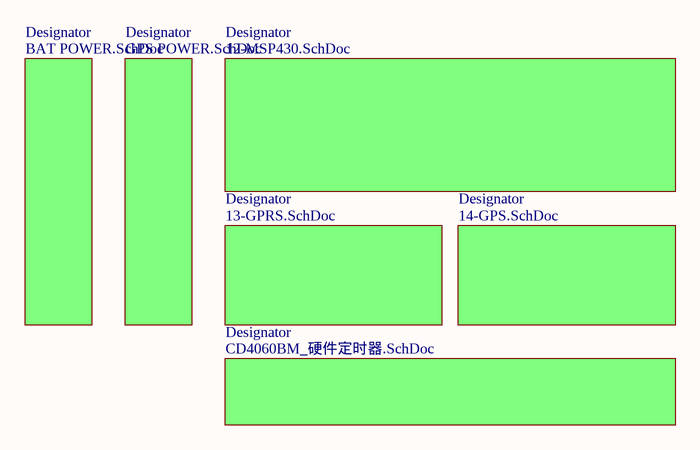
[diagram p17: GPS总图.SchDoc]

### Sub-sheets
Designator = 12-MSP430.SchDoc: no entries
Designator = 13-GPRS.SchDoc: no entries
Designator = 14-GPS.SchDoc: no entries
Designator = GPS POWER.SchDoc: no entries
Designator = BAT POWER.SchDoc: no entries
Designator = CD4060BM_硬件定时器.SchDoc: no entries

## Sheet 12-MSP430.SchDoc
size A4
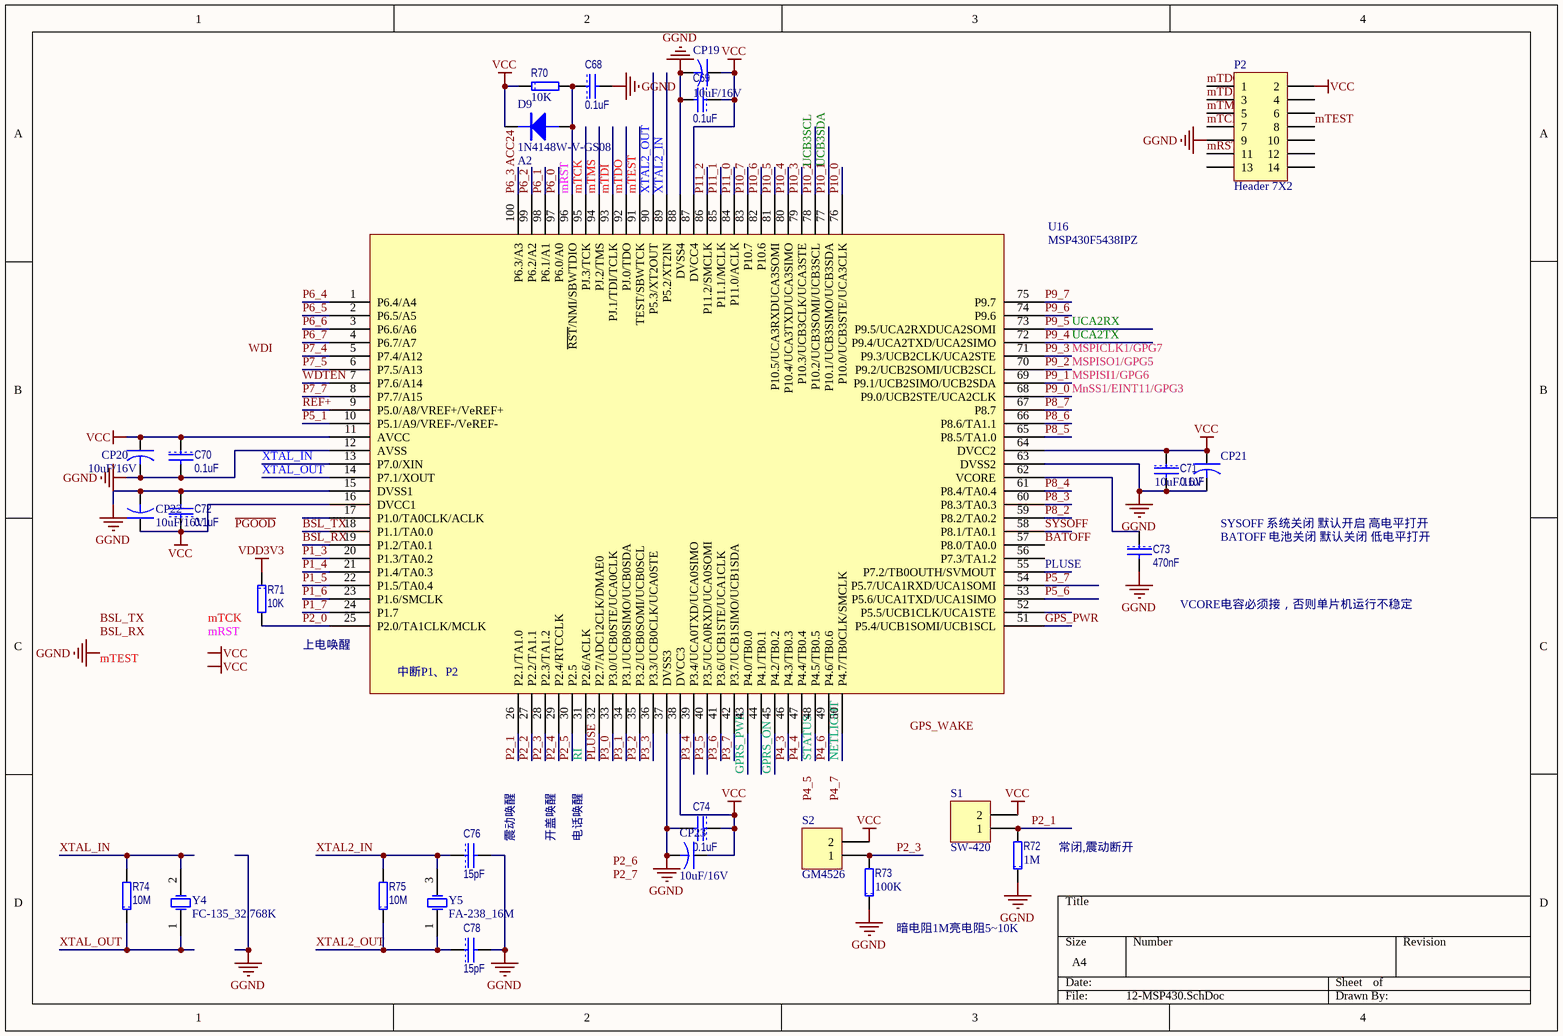
[diagram p18: 12-MSP430.SchDoc]

### Parts
C68  0.1uF  [1608[0603]]
C69  0.1uF  [1608[0603]]
C70  0.1uF  [1608[0603]]
C71  0.1uF  [1608[0603]]
C72  0.1uF  [1608[0603]]
C73  470nF  [1608[0603]]
C74  0.1uF  [1608[0603]]
C76  15pF  [1608[0603]]
C78  15pF  [1608[0603]]
CP19  10uF/16V  [3216[1206]]
CP20  10uF/16V  [3216[1206]]
CP21  10uF/16V  [3216[1206]]
CP22  10uF/16V  [3216[1206]]
CP23  10uF/16V  [3216[1206]]
D9  1N4148W-V-GS08  value A2  [SOD323]
P2  Header 7X2  [HDR2X7]
R70  value 10K  [1608[0603]R]  (hidden comment: CRCW060310K0FKEA)
R71  10K  [1608[0603]R]
R72  value 1M  [1608[0603]R]  (hidden comment: CRCW06031M00FKEA)
R73  value 100K  [1608[0603]R]  (hidden comment: CRCW0603100KFKEA)
R74  10M  [1608[0603]R]
R75  10M  [1608[0603]R]
S1  SW-420  [SW-420]
S2  GM4526  [GM4526]
U16  MSP430F5438IPZ  [TQFP100_N]
Y4  FC-135_32.768K  [FC-135]
Y5  FA-238_16M  [FA-238]

### Nets
GGND: C68.2 C69.2 C70.2 C71.2 C72.2 C73.2 C74.2 C76.2 C78.2 CP19.2 CP20.2 CP21.2 CP22.2 CP23.2 P2.9 R72.1 R73.1 U16.12(AVSS) U16.15(DVSS1) U16.37(DVSS3) U16.63(DVSS2) U16.88(DVSS4)  [project net GND]
VCC: C69.1 C70.1 C71.1 C72.1 C74.1 CP19.1 CP20.1 CP21.1 CP22.1 CP23.1 D9.2(K) P2.2 R70.1 S1.2 S2.2 U16.11(AVCC) U16.16(DVCC1) U16.38(DVCC3) U16.64(DVCC2) U16.87(DVCC4)
VDD3V3: R71.1
ACC24: U16.100(P6.3/A3)  [also labelled P6_3]
BATOFF: U16.57(P8.0/TA0.0)
BSL_RX: U16.19(P1.2/TA0.1)
BSL_TX: U16.18(P1.1/TA0.0)
GPRS_ON: U16.45(P4.2/TB0.2)
GPRS_PWR: U16.43(P4.0/TB0.0)
GPS_PWR: U16.51(P5.4/UCB1SOMI/UCB1SCL)
MnSS1/EINT11/GPG3: U16.68(P9.0/UCB2STE/UCA2CLK)  [also labelled P9_0]
mRST: C68.1 D9.1(A) P2.11 R70.2 U16.96(~{RST}/NMI/SBWTDIO)
MSPICLK1/GPG7: U16.71(P9.3/UCB2CLK/UCA2STE)  [also labelled P9_3]
MSPISI1/GPG6: U16.69(P9.1/UCB2SIMO/UCB2SDA)  [also labelled P9_1]
MSPISO1/GPG5: U16.70(P9.2/UCB2SOMI/UCB2SCL)  [also labelled P9_2]
mTCK: P2.7 U16.95(PJ.3/TCK)
mTDI: P2.3 U16.93(PJ.1/TDI/TCLK)
mTDO: P2.1 U16.92(PJ.0/TDO)
mTEST: P2.8 U16.91(TEST/SBWTCK)
mTMS: P2.5 U16.94(PJ.2/TMS)
NETLIGHT: U16.50(P4.7/TB0CLK/SMCLK)
P1_3: U16.20(P1.3/TA0.2)
P1_4: U16.21(P1.4/TA0.3)
P1_5: U16.22(P1.5/TA0.4)
P1_6: U16.23(P1.6/SMCLK)
P1_7: U16.24(P1.7)
P2_0: R71.2 U16.25(P2.0/TA1CLK/MCLK)
P2_1: R72.2 S1.1 U16.26(P2.1/TA1.0)
P2_2: U16.27(P2.2/TA1.1)
P2_3: R73.2 S2.1 U16.28(P2.3/TA1.2)
P2_4: U16.29(P2.4/RTCCLK)
P2_5: U16.30(P2.5)
P3_0: U16.33(P3.0/UCB0STE/UCA0CLK)
P3_1: U16.34(P3.1/UCB0SIMO/UCB0SDA)
P3_2: U16.35(P3.2/UCB0SOMI/UCB0SCL)
P3_3: U16.36(P3.3/UCB0CLK/UCA0STE)
P3_4: U16.39(P3.4/UCA0TXD/UCA0SIMO)
P3_5: U16.40(P3.5/UCA0RXD/UCA0SOMI)
P3_6: U16.41(P3.6/UCB1STE/UCA1CLK)
P3_7: U16.42(P3.7/UCB1SIMO/UCB1SDA)
P4_3: U16.46(P4.3/TB0.3)
P4_4: U16.47(P4.4/TB0.4)
P4_6: U16.49(P4.6/TB0.6)
P5_1: U16.10(P5.1/A9/VREF-/VeREF-)
P5_6: U16.53(P5.6/UCA1TXD/UCA1SIMO)
P5_7: U16.54(P5.7/UCA1RXD/UCA1SOMI)
P6_0: U16.97(P6.0/A0)
P6_1: U16.98(P6.1/A1)
P6_2: U16.99(P6.2/A2)
P6_4: U16.1(P6.4/A4)
P6_5: U16.2(P6.5/A5)
P6_6: U16.3(P6.6/A6)
P6_7: U16.4(P6.7/A7)
P7_4: U16.5(P7.4/A12)
P7_5: U16.6(P7.5/A13)
P7_7: U16.8(P7.7/A15)
P8_2: U16.59(P8.2/TA0.2)
P8_3: U16.60(P8.3/TA0.3)
P8_4: U16.61(P8.4/TA0.4)
P8_5: U16.65(P8.5/TA1.0)
P8_6: U16.66(P8.6/TA1.1)
P8_7: U16.67(P8.7)
P9_4: U16.72(P9.4/UCA2TXD/UCA2SIMO)  [also labelled UCA2TX]
P9_5: U16.73(P9.5/UCA2RXDUCA2SOMI)  [also labelled UCA2RX]
P9_6: U16.74(P9.6)
P9_7: U16.75(P9.7)
P10_0: U16.76(P10.0/UCB3STE/UCA3CLK)
P10_1: U16.77(P10.1/UCB3SIMO/UCB3SDA)  [also labelled UCB3SDA]
P10_2: U16.78(P10.2/UCB3SOMI/UCB3SCL)  [also labelled UCB3SCL]
P10_3: U16.79(P10.3/UCB3CLK/UCA3STE)
P10_4: U16.80(P10.4/UCA3TXD/UCA3SIMO)
P10_5: U16.81(P10.5/UCA3RXDUCA3SOMI)
P10_6: U16.82(P10.6)
P10_7: U16.83(P10.7)
P11_0: U16.84(P11.0/ACLK)
P11_1: U16.85(P11.1/MCLK)
P11_2: U16.86(P11.2/SMCLK)
PLUSE: U16.32(P2.7/ADC12CLK/DMAE0) U16.55(P7.2/TB0OUTH/SVMOUT)
REF+: U16.9(P5.0/A8/VREF+/VeREF+)
RI: U16.31(P2.6/ACLK)
STATUS: U16.48(P4.5/TB0.5)
SYSOFF: U16.58(P8.1/TA0.1)
WDTEN: U16.7(P7.6/A14)
XTAL2_IN: C76.1 R75.2 U16.89(P5.2/XT2IN) Y5.3(OSC2)
XTAL2_OUT: C78.1 R75.1 U16.90(P5.3/XT2OUT) Y5.1(OSC1)
XTAL_IN: R74.2 U16.13(P7.0/XIN) Y4.2(OSC2)
XTAL_OUT: R74.1 U16.14(P7.1/XOUT) Y4.1(OSC1)
NetC73_1: C73.1 U16.62(VCORE)

Not connected (* = marked no-connect by the designer): P2 4 6 10 12 13 14; U16 17(P1.0/TA0CLK/ACLK) 44(P4.1/TB0.1) 52(P5.5/UCB1CLK/UCA1STE) 56(P7.3/TA1.2)

### Notes on the sheet
- BATOFF 电池关闭 默认关闭 低电平打开
- SYSOFF 系统关闭 默认开启 高电平打开
- 上电唤醒
- VCORE电容必须接，否则单片机运行不稳定
- (near U16) 中断P1、P2
- (near C76) 震动唤醒
- 开盖唤醒
- 电话唤醒
- (near R72) 常闭,震动断开
- (near R73) 暗电阻1M亮电阻5~10K
- Labels drawn without touching a wire or pin: BSL_RX, BSL_TX, GGND, GPS_WAKE, mRST, mTCK, mTEST, P2_6, P2_7, P4_5, P4_7, VCC, WDI, ~{PGOOD}

### Library data of the parts
C68-C72 C74 = CAP: as C54 on sheet ARM POWER; Value: 0.1uF
C73 = CAP: Capacitor; Manufacturer: TDK; Type: 无铅电容; Model: C0603X7R1H474K; Value: 470nF
C76 C78 = CAP: Capacitor; Manufacturer: TDK; Type: 无铅电容; Model: C0603X7R1H150K; Value: 15pF
CP19-CP23 = CAPACITOR: Tantalum Capacitor; 公司: TAJ; name: TAJ-A-106-M-010-R; value: 10uF/16V
D9 = 1N4148W: 二极管 - 通用，功率，开关 100V Io/150mA; Manufacturer: Vishay Semiconductors; 配置: Single; 工作温度范围: - 65 C to + 150 C; 封装 / 箱体: SOD-123; 封装: Reel; 产品: Switching Diodes; 正向连续电流: 0.15 A; 最大浪涌电流: 0.5 A; 安装风格: SMD/SMT; 恢复时间: 4 ns; 正向电压下降: 1.2 V; 制造商: Vishay; 最大二极管电容: 4 pF; 最大工作温度: + 150 C; 最大功率耗散: 350 mW; 最大反向漏泄电流: 5 uA; 最小工作温度: - 65 C; 标准包装数量: 15000; Supplier 1: Mouser; Supplier Part Number 1: 625-1N4148W-V; Manufacturer Part Number: 1N4148W-V-GS08; RoHS: RoHS Compliant; Category: 二极管 - 通用，功率，开关; Stock 1: 404148; Pricing 1: 1=0.090, 10=0.083, 50=0.072, 100=0.068, 500=0.032, 1000=0.026, 3000=0.021, 9000=0.016, 10000=0.016, 18000=0.014 (USD); 峰值反向电压: 100 V; 产品种类: Switching Diodes; RoHS - 贸泽: Y; Minimum Order Quantity: 1; Reeling: True; ComponentLink1URL: http://www.mouser.com/ds/2/427/1n4148w--240387.pdf; ComponentLink1Description: http://www.mouser.com/ds/2/427/1n4148w--240387.pdf; Description 1: 二极管 - 通用，功率，开关 100V Io/150mA
P2 = Header 7X2: Header, 7-Pin, Dual row; LatestRevisionDate: 17-Jul-2002; LatestRevisionNote: Re-released for DXP Platform.; Publisher: Altium Limited
R70 = RES: 厚膜电阻器 - SMD 1/10watt 10Kohms 1%; Manufacturer: Vishay / Dale; 尺寸: 0.85 mm W x 1.55 mm L x 0.45 mm H; 工作温度范围: - 55 C to + 155 C; 封装 / 箱体: 0603 (1608 metric); 封装: Reel; 功率额定值: 100 mW; 产品: Thick Film Resistors SMD; 系列: CRCW; 温度系数: 100 PPM / K; 端接类型: SMD/SMT; 电压额定值: 75 V; 制造商: Vishay; 产品种类: 0603 Thick Film Chip Resistors; 标准包装数量: 5000; 外壳代码 - in: 0603; 外壳代码 - mm: 1608; Supplier 1: Mouser; Supplier Part Number 1: 71-CRCW0603-10K-E3; Manufacturer Part Number: CRCW060310K0FKEA; RoHS: RoHS Compliant By Exemption; Category: 厚膜电阻器 - SMD; Stock 1: 0; Pricing 1: 1=0.080, 10=0.013, 100=0.010, 1000=0.008, 5000=0.005, 25000=0.004, 50000=0.003 (USD); 电阻: 10 kOhms; 容差: 1 %; RoHS - 贸泽: E; Minimum Order Quantity: 1; Reeling: True; ComponentLink1URL: http://www.mouser.com/ds/2/427/dcrcwe3-109170.pdf; ComponentLink1Description: http://www.mouser.com/ds/2/427/dcrcwe3-109170.pdf; Description 1: 厚膜电阻器 - SMD 1/10watt 10Kohms 1%
R71 = RES: Model: RT0603DRD7D10KL; 公司: vishay; Parameters: 50V 1/10W 0.5%; Type: 无铅电阻; Value: 10K
R72 = RES: 厚膜电阻器 - SMD 1/10watt 1.0Mohms 1%; Manufacturer: Vishay / Dale; 尺寸: 0.85 mm W x 1.55 mm L x 0.45 mm H; 工作温度范围: - 55 C to + 155 C; 封装 / 箱体: 0603 (1608 metric); 封装: Reel; 功率额定值: 100 mW; 产品: Thick Film Resistors SMD; 电阻: 1 MOhms; 系列: CRCW; 温度系数: 100 PPM / K; 端接类型: SMD/SMT; 电压额定值: 75 V; 外壳代码 - in: 0603; 外壳代码 - mm: 1608; 制造商: Vishay; 产品种类: 0603 Thick Film Chip Resistors; 标准包装数量: 5000; Supplier 1: Mouser; Supplier Part Number 1: 71-CRCW0603-1.0M-E3; Manufacturer Part Number: CRCW06031M00FKEA; RoHS: RoHS Compliant By Exemption; Category: 厚膜电阻器 - SMD; Stock 1: 71394; Pricing 1: 1=0.080, 10=0.013, 100=0.010, 1000=0.008, 5000=0.005, 25000=0.004, 50000=0.003 (USD); 容差: 1 %; RoHS - 贸泽: E; Minimum Order Quantity: 1; Reeling: True; ComponentLink1URL: http://www.mouser.com/ds/2/427/dcrcwe3-109170.pdf; ComponentLink1Description: http://www.mouser.com/ds/2/427/dcrcwe3-109170.pdf; Description 1: 厚膜电阻器 - SMD 1/10watt 1.0Mohms 1%
R73 = RES: 厚膜电阻器 - SMD 1/10watt 100Kohms 1%; Manufacturer: Vishay / Dale; 尺寸: 0.85 mm W x 1.55 mm L x 0.45 mm H; 工作温度范围: - 55 C to + 155 C; 封装 / 箱体: 0603 (1608 metric); 封装: Reel; 功率额定值: 100 mW; 产品: Thick Film Resistors SMD; 系列: CRCW; 温度系数: 100 PPM / K; 端接类型: SMD/SMT; 电压额定值: 75 V; 制造商: Vishay; 产品种类: 0603 Thick Film Chip Resistors; 标准包装数量: 5000; 外壳代码 - in: 0603; 外壳代码 - mm: 1608; Supplier 1: Mouser; Supplier Part Number 1: 71-CRCW0603-100K-E3; Manufacturer Part Number: CRCW0603100KFKEA; RoHS: RoHS Compliant By Exemption; Category: 厚膜电阻器 - SMD; Stock 1: 175756; Pricing 1: 1=0.080, 10=0.013, 100=0.010, 1000=0.008, 5000=0.005, 25000=0.004, 50000=0.003 (USD); 电阻: 100 kOhms; 容差: 1 %; RoHS - 贸泽: E; Minimum Order Quantity: 1; Reeling: True; ComponentLink1URL: http://www.mouser.com/ds/2/427/dcrcwe3-109170.pdf; ComponentLink1Description: http://www.mouser.com/ds/2/427/dcrcwe3-109170.pdf; Description 1: 厚膜电阻器 - SMD 1/10watt 100Kohms 1%
R74 R75 = RES: Model: RT0603DRD7D10ML; 公司: vishay; Parameters: 50V 1/10W 0.5%; Type: 无铅电阻; Value: 10M
S1 = Header 2: 插针 工业级震动传感器; 公司: 百灵电子; LatestRevisionDate: 17-Jul-2002; LatestRevisionNote: Re-released for DXP Platform.; Publisher: Altium Limited
S2 = Header 2: 插针 光敏传感器; 公司: 百灵电子; LatestRevisionDate: 17-Jul-2002; LatestRevisionNote: Re-released for DXP Platform.; Publisher: Altium Limited
U16 = MSP430F5438: 处理器; 公司: TI
Y4 = XTAL: Crystal Oscillator; 公司: EPSON; Published: 8-Jun-2000; LatestRevisionDate: 17-Jul-2002; LatestRevisionNote: Re-released for DXP Platform.; PackageReference: R38; Publisher: Altium Limited; PackageDescription: Crystal, Thru-Hole; 2 Leads; Body 3.1 x 8.2 mm (Dia.xH); Value: 32.768K
Y5 = XTAL: Crystal Oscillator; 公司: EPSON; Value: 16M; Published: 8-Jun-2000; LatestRevisionDate: 17-Jul-2002; LatestRevisionNote: Re-released for DXP Platform.; PackageReference: R38; Publisher: Altium Limited; PackageDescription: Crystal, Thru-Hole; 2 Leads; Body 3.1 x 8.2 mm (Dia.xH)

## Sheet 13-GPRS.SchDoc
size A4
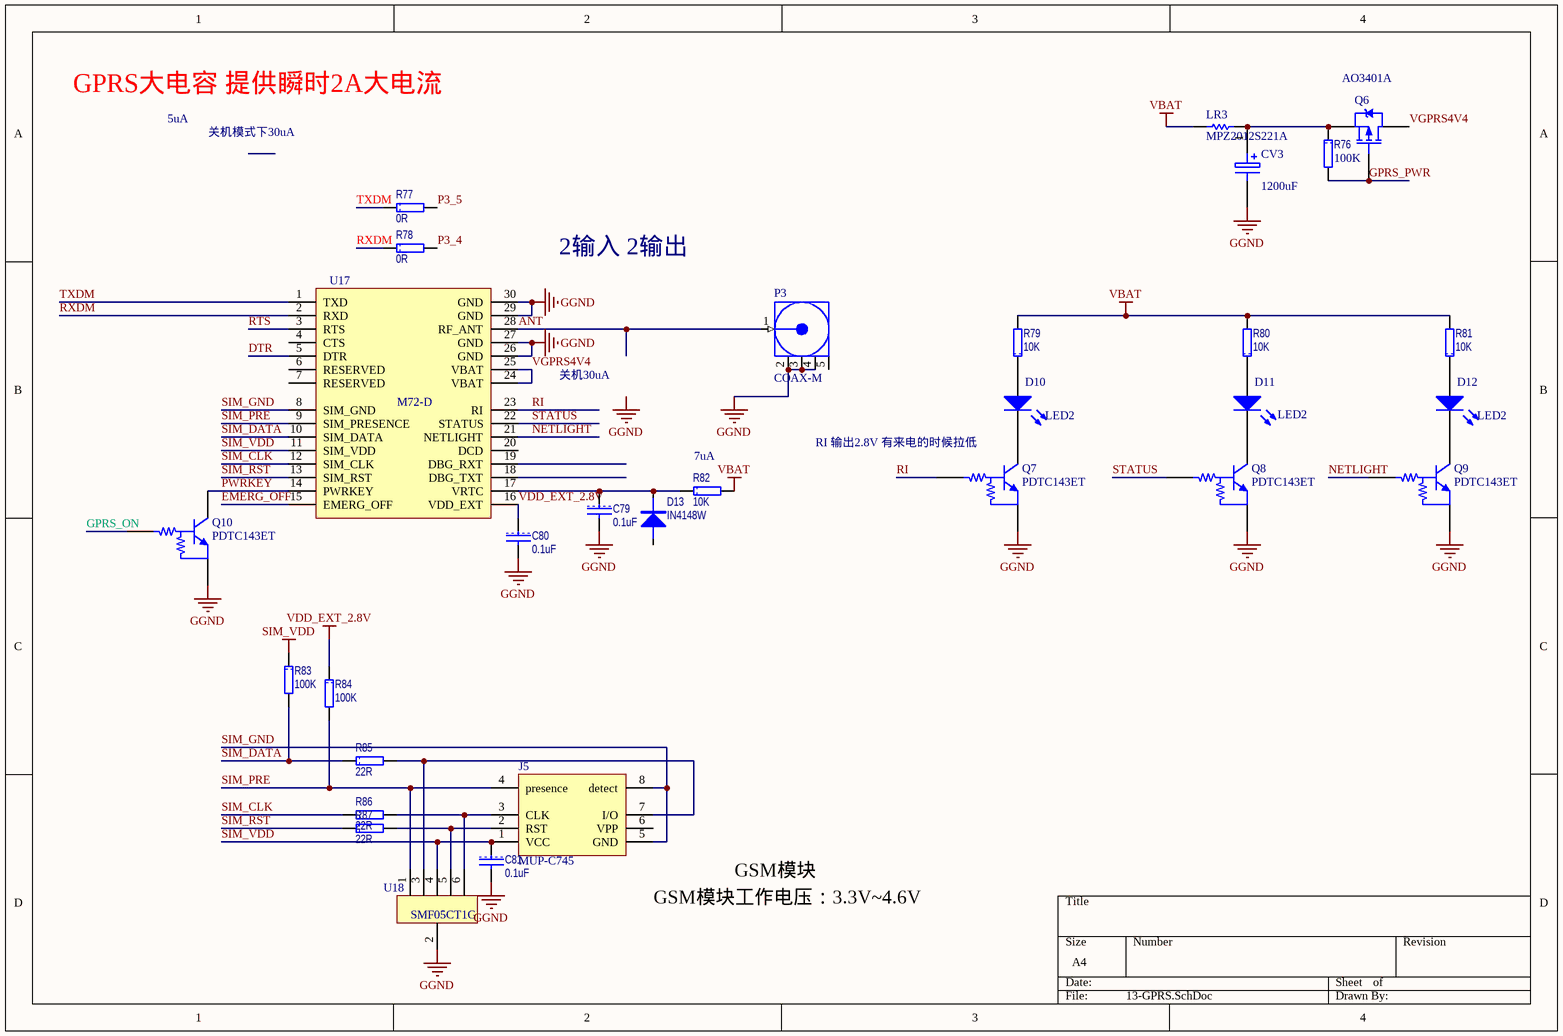
[diagram p19: 13-GPRS.SchDoc]

### Parts
C79  0.1uF  [1608[0603]]
C80  0.1uF  [1608[0603]]
C81  0.1uF  [1608[0603]]
CV3  value 1200uF  [CAPPR5-10x20/H1.1]  (hidden comment: EEUFC1A122)
D10  LED2  [0805LED]
D11  LED2  [0805LED]
D12  LED2  [0805LED]
D13  IN4148W  [SOD123]
J5  MUP-C745  [MUP-C745]
LR3  MPZ2012S221A  [2012[0805]]
P3  COAX-M  [MHF[MCB3]-V4]
Q6  AO3401A  [SOT23_N]
Q7  PDTC143ET  [SOT23_N]
Q8  PDTC143ET  [SOT23_N]
Q9  PDTC143ET  [SOT23_N]
Q10  PDTC143ET  [SOT23_N]
R76  value 100K  [1608[0603]R]  (hidden comment: CRCW0603100KFKEA)
R77  0R  [1608[0603]R]
R78  0R  [1608[0603]R]
R79  10K  [1608[0603]R]
R80  10K  [1608[0603]R]
R81  10K  [1608[0603]R]
R82  10K  [1608[0603]R]
R83  100K  [1608[0603]R]
R84  100K  [1608[0603]R]
R85  22R  [1608[0603]R]
R86  22R  [1608[0603]R]
R87  22R  [1608[0603]R]
U17  M72-D  [M72D]
U18  SMF05CT1G  [SOT23-6_N]

### Nets
GGND: C79.2 C80.2 C81.2 CV3.2 P3.2(GND) P3.3(GND) P3.4(GND) Q7.2(E) Q8.2(E) Q9.2(E) Q10.2(E) U17.26(GND) U17.27(GND) U17.29(GND) U17.30(GND) U18.2  [project net GND]
SIM_VDD: C81.1 J5.1(VCC) R83.1 U17.11(SIM_VDD) U18.4
VBAT: LR3.1 R79.2 R80.2 R81.2 R82.2
VDD_EXT_2.8V: C80.1 R84.1 U17.16(VDD_EXT)
ANT: P3.1(Signal) U17.28(RF_ANT)
DTR: U17.5(DTR)
EMERG_OFF: U17.15(EMERG_OFF)
GPRS_ON: Q10.1(B)
GPRS_PWR: Q6.1(G) R76.2
NETLIGHT: Q9.1(B) U17.21(NETLIGHT)
P3_4: R78.2
P3_5: R77.2
PWRKEY: Q10.3(C) U17.14(PWRKEY)
RI: Q7.1(B) U17.23(RI)
RTS: U17.3(RTS)
RXDM: R78.1 U17.2(RXD)
SIM_CLK: R86.1 U17.12(SIM_CLK)
SIM_DATA: R83.2 R85.1 U17.10(SIM_DATA)
SIM_GND: J5.5(GND) J5.8(detect) U17.8(SIM_GND)
SIM_PRE: J5.4(presence) R84.2 U17.9(SIM_PRESENCE) U18.1
SIM_RST: R87.1 U17.13(SIM_RST)
STATUS: Q8.1(B) U17.22(STATUS)
TXDM: R77.1 U17.1(TXD)
VGPRS4V4: Q6.3(D) U17.24(VBAT) U17.25(VBAT)
NetC79_1: C79.1 D13.2 R82.1 U17.17(VRTC)
NetCV3_1: CV3.1 LR3.2 Q6.2(S) R76.1
NetD10_1: D10.1(A) R79.1
NetD10_2: D10.2(K) Q7.3(C)
NetD11_1: D11.1(A) R80.1
NetD11_2: D11.2(K) Q8.3(C)
NetD12_1: D12.1(A) R81.1
NetD12_2: D12.2(K) Q9.3(C)
NetJ5_2: J5.2(RST) R87.2 U18.5
NetJ5_3: J5.3(CLK) R86.2 U18.6
NetJ5_7: J5.7(I/O) R85.2 U18.3

Not connected (* = marked no-connect by the designer): D13 1; J5 6(VPP); P3 5(GND); U17 4(CTS) 6(RESERVED) 7(RESERVED) 18(DBG_TXT) 19(DBG_RXT) 20(DCD)

### Notes on the sheet
- GPRS大电容 提供瞬时2A大电流
- 5uA
- 关机模式下30uA
- 2输入 2输出
- 关机30uA
- (near Q7) RI 输出2.8V 有来电的时候拉低
- (near R82) 7uA
- (near J5) GSM模块工作电压：3.3V~4.6V
- GSM模块
- Labels drawn without touching a wire or pin: GGND

### Library data of the parts
C79-C81 = CAP: as C54 on sheet ARM POWER; Value: 0.1uF
CV3 = ELECTRO1: 插针 铝质电解电容器 - 带引线 1200uF 10V; Manufacturer: Panasonic Electronic Components; Manufacturer Part Number: EEU-FC1A122; 工作温度范围: - 55 C to + 105 C; 封装: Bulk; 产品: High Temp Electrolytic Capacitors; 系列: FC; 端接类型: Radial; 容差: 20 %; 外壳直径: 10 mm; 外壳长度: 20 mm; 引线间隔: 5 mm; 制造商: Panasonic; 产品种类: Radial Electrolytic Aluminum Capacitors; 标准包装数量: 200; Supplier 1: Mouser; Supplier Part Number 1: 667-EEU-FC1A122; RoHS: RoHS Compliant; Description 1: 铝质电解电容器 - 带引线 1200uF 10V; Category: 铝质电解电容器 - 带引线; Stock 1: 1597; Pricing 1: 1=0.330, 25=0.300, 100=0.275, 250=0.254, 500=0.250, 1000=0.241, 2000=0.230, 5000=0.214 (USD); 电容: 1200 uF; 电压额定值: 10 V; RoHS - 贸泽: Y; Minimum Order Quantity: 1; Reeling: False; ComponentLink1URL: http://www.mouser.com/ds/2/315/ABA0000CE22-7179.pdf; ComponentLink1Description: http://www.mouser.com/ds/2/315/ABA0000CE22-7179.pdf
D10-D12 = LED2: Typical RED, GREEN, YELLOW, AMBER GaAs LED; Published: 8-Jun-2000; LatestRevisionDate: 17-Jul-2002; LatestRevisionNote: Re-released for DXP Platform.; PackageVersion: Feb-2002; PackageReference: 3.2X1.6X1.1; Publisher: Altium Limited; PackageDescription: SM LED; 2 Flat Leads
D13 = DIODE
J5 = SIMCARD: CON; 公司: MUP
LR3 = Res Semi: 电磁干扰滤波珠子、扼流圈和阵列 Ferrite Chip Beads; Manufacturer: TDK; 阻抗: 220 Ohms; 最大直流电流: 3 A; 最大直流电阻: 0.04 Ohms; 工作温度范围: - 55 C to + 125 C; 封装 / 箱体: 2012; 封装: Reel; 端接类型: SMD/SMT; 容差: 25 %; 产品种类: Ferrite Beads; 标准包装数量: 4000; Supplier 1: Mouser; Supplier Part Number 1: 810-MPZ2012S221A; Manufacturer Part Number: MPZ2012S221A; RoHS: RoHS Compliant; Description 1: 电磁干扰滤波珠子、扼流圈和阵列 Ferrite Chip Beads; Category: 电磁干扰滤波珠子、扼流圈和阵列; Stock 1: 26540; Pricing 1: 1=0.070, 50=0.060, 100=0.053, 500=0.040, 1000=0.035, 4000=0.031, 8000=0.029, 12000=0.025 (USD); 制造商: TDK; RoHS - 贸泽: Y; Minimum Order Quantity: 1; Reeling: True; ComponentLink1URL: http://www.mouser.com/ds/2/400/e9413_mpz-24582.pdf; ComponentLink1Description: http://www.mouser.com/ds/2/400/e9413_mpz-24582.pdf
P3 = COAX-M: RF Coaxial PCB Connector, MMCX; Thru-Hole, Vertical Mount Plug,  50 Ohm Impedance; PackageDocument: Rev. A, 16-Jun-1997; PCB_Layout: Complies with manufacturer's recommendation.; DrillSize: Corresponds to nominal value.; Published: 15-Jul-2004; LatestRevisionDate: 15-Jul-2004; LatestRevisionNote: Component Replaced.; DatasheetDocument: 30-May-2003; PackageReference: 908-21103; Publisher: Altium Limited; ComponentLink1Description: Manufacturer Link; ComponentLink1URL: http://www.amphenolrf.com/
Q6 = IRLML5103: MOSFET P-CH -30V -4.3A SOT23; Manufacturer: Alpha & Omega Semiconductor Inc; FET Type: MOSFET P-Channel, Metal Oxide; FET Feature: Logic Level Gate, 2.5V Drive; Drain to Source Voltage (Vdss): 30V; Current - Continuous Drain (Id) @ 25° C: 4.3A (Ta); Rds On (Max) @ Id, Vgs: 44 mOhm @ 4.3A, 10V; Vgs(th) (Max) @ Id: 1.3V @ 250μA; Gate Charge (Qg) @ Vgs: 12.2nC @ 4.5V; Input Capacitance (Ciss) @ Vds: 1200pF @ 15V; Power - Max: 1.4W; Supplier 1: Digi-Key; Supplier Part Number 1: 785-1001-6-ND; Manufacturer Part Number: AO3401A; RoHS: RoHS Compliant; Description 1: MOSFET P-CH -30V -4.3A SOT23; Category: Discrete Semiconductor Products; Stock 1: 75922; Pricing 1: 1=0.48, 25=0.2792, 100=0.225, 250=0.162, 500=0.1305, 1000=0.10125 (USD); Packaging: Digi-Reel?; Mounting Type: Surface Mount; Package / Case: TO-236-3, SC-59, SOT-23-3; Supplier Device Package: SOT-23-3; ComponentLink1URL: http://www.aosmd.com/res/data_sheets/AO3401A.pdf; ComponentLink1Description: http://www.aosmd.com/res/data_sheets/AO3401A.pdf
Q7-Q10 = PDTC143ET: NPN Resistor-equipped Transistor; Published: 17-Sep-2003; LatestRevisionDate: 12-Dec-2006; LatestRevisionNote: IPC-7351 Footprint Added.; DatasheetVersion: 15-Apr-1999; PackageVersion: May-1999; PackageReference: SOT23; Publisher: Altium Limited; PackageDescription: 3-Pin SOT-23 Package 0.95 mm Pitch, 2.3 mm Lead Span; ComponentLink1Description: Manufacturer Link; ComponentLink1URL: http://www.semiconductors.philips.com/; ComponentLink2Description: Datasheet; ComponentLink2URL: http://www.semiconductors.philips.com/acrobat/datasheets/PDTC143E_SERIES_9.pdf
R76 = RES: as R73 on sheet 12-MSP430; Supplier 1: Mouser; Supplier Part Number 1: 71-CRCW0603-100K-E3; Manufacturer Part Number: CRCW0603100KFKEA; RoHS: RoHS Compliant By Exemption; Category: 厚膜电阻器 - SMD; Stock 1: 175756; Pricing 1: 1=0.080, 10=0.013, 100=0.010, 1000=0.008, 5000=0.005, 25000=0.004, 50000=0.003 (USD); 电阻: 100 kOhms; 容差: 1 %; RoHS - 贸泽: E; Minimum Order Quantity: 1; Reeling: True; ComponentLink1URL: http://www.mouser.com/ds/2/427/dcrcwe3-109170.pdf; ComponentLink1Description: http://www.mouser.com/ds/2/427/dcrcwe3-109170.pdf; Description 1: 厚膜电阻器 - SMD 1/10watt 100Kohms 1%
R77 R78 = RES: Model: RT0603DRD7D0RL; 公司: vishay; Parameters: 50V 1/10W 0.5%; Type: 无铅电阻; Value: 0R
R79-R82 = RES: Model: CRCW060310K0KKEDTR; 公司: vishay; Parameters: 50V 1/10W 0.5%; Type: 无铅电阻; Value: 10K
R83 R84 = RES: Model: CRCW0603100K0KKEDTR; 公司: vishay; Parameters: 50V 1/10W 0.5%; Type: 无铅电阻; Value: 100K
R85-R87 = RES: Model: CRCW060322R0KKEDTR; 公司: vishay; Parameters: 50V 1/10W 0.5%; Type: 无铅电阻; Value: 22R
U17 = M72-D: GSM模块; 公司: 上海移远
U18 = SMF05CT1G: ESD; 公司: ON

## Sheet 14-GPS.SchDoc
size A4
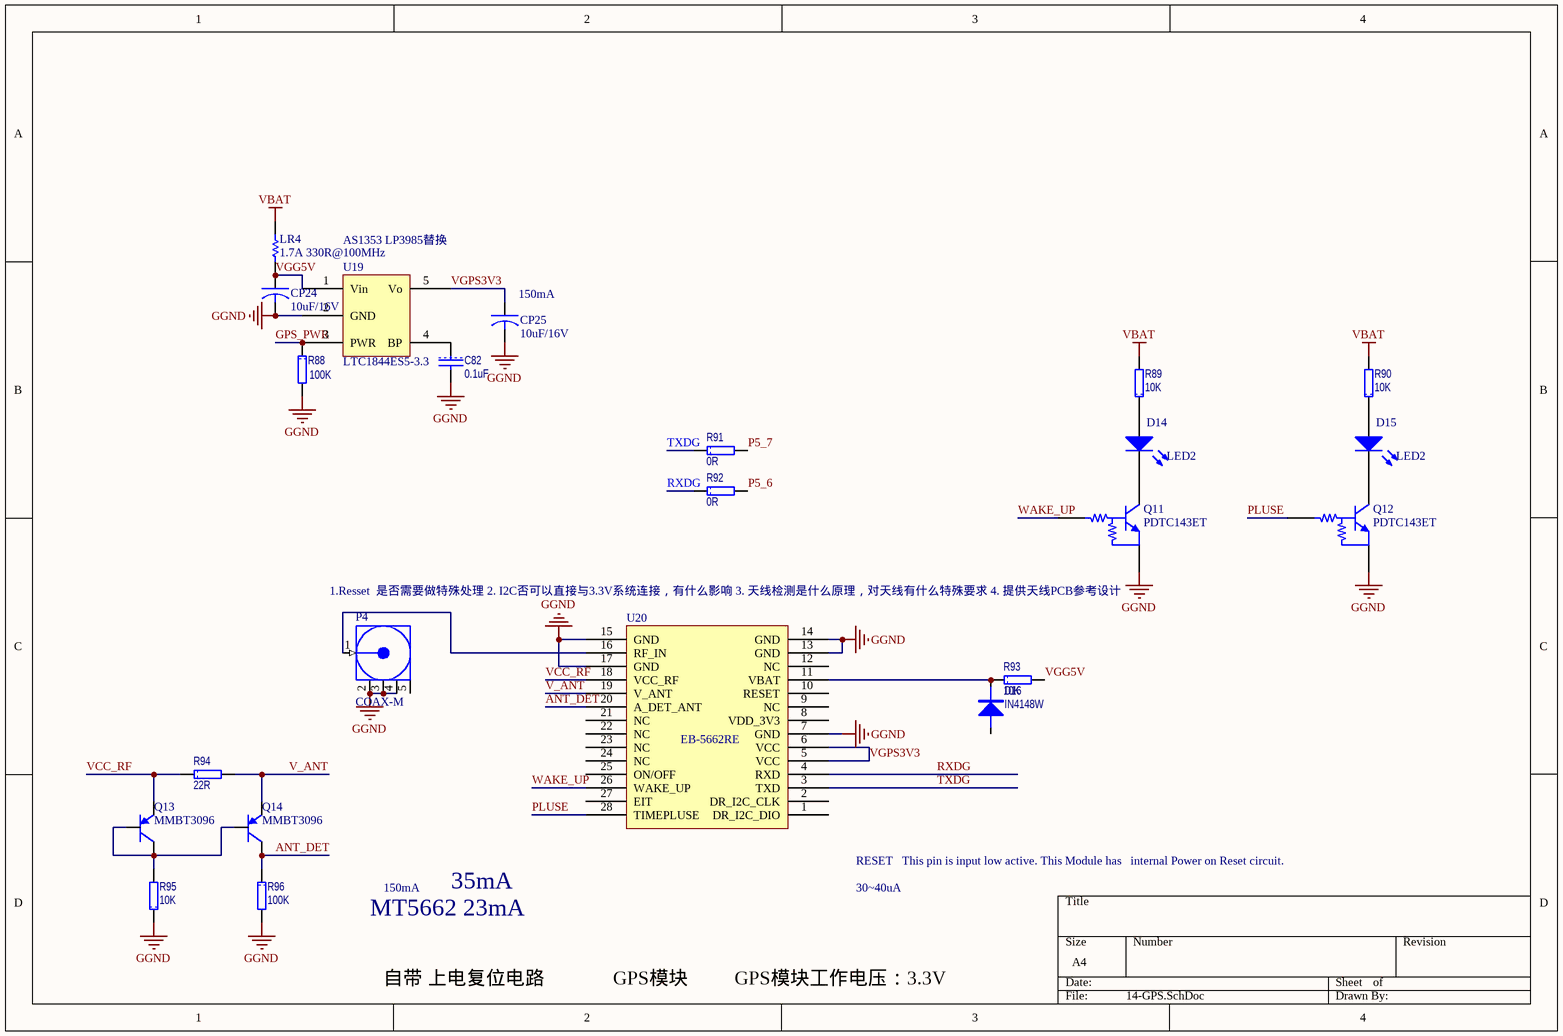
[diagram p20: 14-GPS.SchDoc]

### Parts
C82  0.1uF  [1608[0603]]
CP24  10uF/16V  [3216[1206]]
CP25  10uF/16V  [3216[1206]]
D14  LED2  [0805LED]
D15  LED2  [0805LED]
D16  IN4148W  [SOD123]
LR4  value 1.7A 330R@100MHz  [1608[0603]RV]  (hidden comment: MPZ1608S331A)
P4  COAX-M  [MHF[MCB3]-V4]
Q11  PDTC143ET  [SOT23_N]
Q12  PDTC143ET  [SOT23_N]
Q13  MMBT3096  [SOT23_N]
Q14  MMBT3096  [SOT23_N]
R88  100K  [1608[0603]R]
R89  10K  [1608[0603]R]
R90  10K  [1608[0603]R]
R91  0R  [1608[0603]R]
R92  0R  [1608[0603]R]
R93  10K  [1608[0603]R]
R94  22R  [1608[0603]R]
R95  10K  [1608[0603]R]
R96  100K  [1608[0603]R]
U19  LTC1844ES5-3.3  [SOT23-5BN]
U20  EB-5662RE  [EB-5662RE]

### Nets
GGND: C82.2 CP24.2 CP25.2 P4.2(GND) P4.3(GND) P4.4(GND) Q11.2(E) Q12.2(E) R88.2 R95.1 R96.2 U19.2(GND) U20.7(GND) U20.13(GND) U20.14(GND) U20.15(GND) U20.17(GND)  [project net GND]
VBAT: LR4.2 R89.2 R90.2
ANT_DET: Q14.3 R96.1 U20.20(A_DET_ANT)
GPS_PWR: R88.1 U19.3(PWR)
P5_6: R92.2
P5_7: R91.2
PLUSE: Q12.1(B) U20.28(TIMEPLUSE)
RXDG: R92.1 U20.4(RXD)
TXDG: R91.1 U20.3(TXD)
V_ANT: Q14.2 R94.2 U20.19(V_ANT)
VCC_RF: Q13.2 R94.1 U20.18(VCC_RF)
VGG5V: CP24.1 LR4.1 R93.2 U19.1(Vin)
VGPS3V3: CP25.1 U19.5(Vo) U20.5(VCC) U20.6(VCC)
WAKE_UP: Q11.1(B) U20.26(WAKE_UP)
NetC82_1: C82.1 U19.4(BP)
NetD14_1: D14.1(A) R89.1
NetD14_2: D14.2(K) Q11.3(C)
NetD15_1: D15.1(A) R90.1
NetD15_2: D15.2(K) Q12.3(C)
NetD16_2: D16.2 R93.1 U20.11(VBAT)
NetP4_1: P4.1(Signal) U20.16(RF_IN)
NetQ13_1: Q13.1 Q13.3 Q14.1 R95.2

Not connected (* = marked no-connect by the designer): D16 1; P4 5(GND); U20 1(DR_I2C_DIO) 2(DR_I2C_CLK) 8(VDD_3V3) 9(NC) 10(RESET) 12(NC) 21(NC) 22(NC) 23(NC) 24(NC) 25(ON/OFF) 27(EIT)

### Notes on the sheet
- (near U19) AS1353 LP3985替换
- (near CP25) 150mA
- 1.Resset  是否需要做特殊处理 2. I2C否可以直接与3.3V系统连接，有什么影响 3. 天线检测是什么原理，对天线有什么特殊要求 4. 提供天线PCB参考设计
- MT5662 23mA
- 150mA
- 35mA
- RESET   This pin is input low active. This Module has   internal Power on Reset circuit.
- 30~40uA
- 自带 上电复位电路
- GPS模块
- GPS模块工作电压：3.3V

### Library data of the parts
C82 = CAP: as C54 on sheet ARM POWER; Value: 0.1uF
CP24 CP25 = CAPACITOR: as CP19 on sheet 12-MSP430; value: 10uF/16V
D14 D15 = LED2: as D10 on sheet 13-GPRS; Published: 8-Jun-2000; LatestRevisionDate: 17-Jul-2002; LatestRevisionNote: Re-released for DXP Platform.; PackageVersion: Feb-2002; PackageReference: 3.2X1.6X1.1; Publisher: Altium Limited; PackageDescription: SM LED; 2 Flat Leads
D16 = DIODE
LR4 = Res Semi: Semiconductor Resistor; 公司: TDK; Published: 8-Jun-2000; LatestRevisionDate: 17-Jul-2002; LatestRevisionNote: Re-released for DXP Platform.; PackageReference: AXIAL-0.5; Publisher: Altium Limited; PackageDescription: Axial Device, Thru-Hole; 2 Leads; 0.5 in Pin Spacing
P4 = COAX-M: as P3 on sheet 13-GPRS; Published: 15-Jul-2004; LatestRevisionDate: 15-Jul-2004; LatestRevisionNote: Component Replaced.; DatasheetDocument: 30-May-2003; PackageReference: 908-21103; Publisher: Altium Limited; ComponentLink1Description: Manufacturer Link; ComponentLink1URL: http://www.amphenolrf.com/
Q11 Q12 = PDTC143ET: NPN Resistor-equipped Transistor; Published: 17-Sep-2003; LatestRevisionDate: 12-Dec-2006; LatestRevisionNote: IPC-7351 Footprint Added.; DatasheetVersion: 15-Apr-1999; PackageVersion: May-1999; PackageReference: SOT23; Publisher: Altium Limited; PackageDescription: 3-Pin SOT-23 Package 0.95 mm Pitch, 2.3 mm Lead Span; ComponentLink1Description: Manufacturer Link; ComponentLink1URL: http://www.semiconductors.philips.com/; ComponentLink2Description: Datasheet; ComponentLink2URL: http://www.semiconductors.philips.com/acrobat/datasheets/PDTC143E_SERIES_9.pdf
Q13 Q14 = MMBT3096: 三极管; 公司: NXP
R88 R96 = RES: as R83 on sheet 13-GPRS; Type: 无铅电阻; Value: 100K
R89 R90 R93 R95 = RES: as R79 on sheet 13-GPRS; Type: 无铅电阻; Value: 10K
R91 R92 = RES: as R77 on sheet 13-GPRS; Type: 无铅电阻; Value: 0R
R94 = RES: Model: RT0603DRD7D22RL; 公司: vishay; Parameters: 50V 1/10W 0.5%; Type: 无铅电阻; Value: 22R
U19 = LT1761: 电源管理; 公司: LTC
U20 = EB-5662RE: GPS模块; 公司: Globalsat